# EAGLE design CC1200_Breakout (EAGLE 6.5.0)
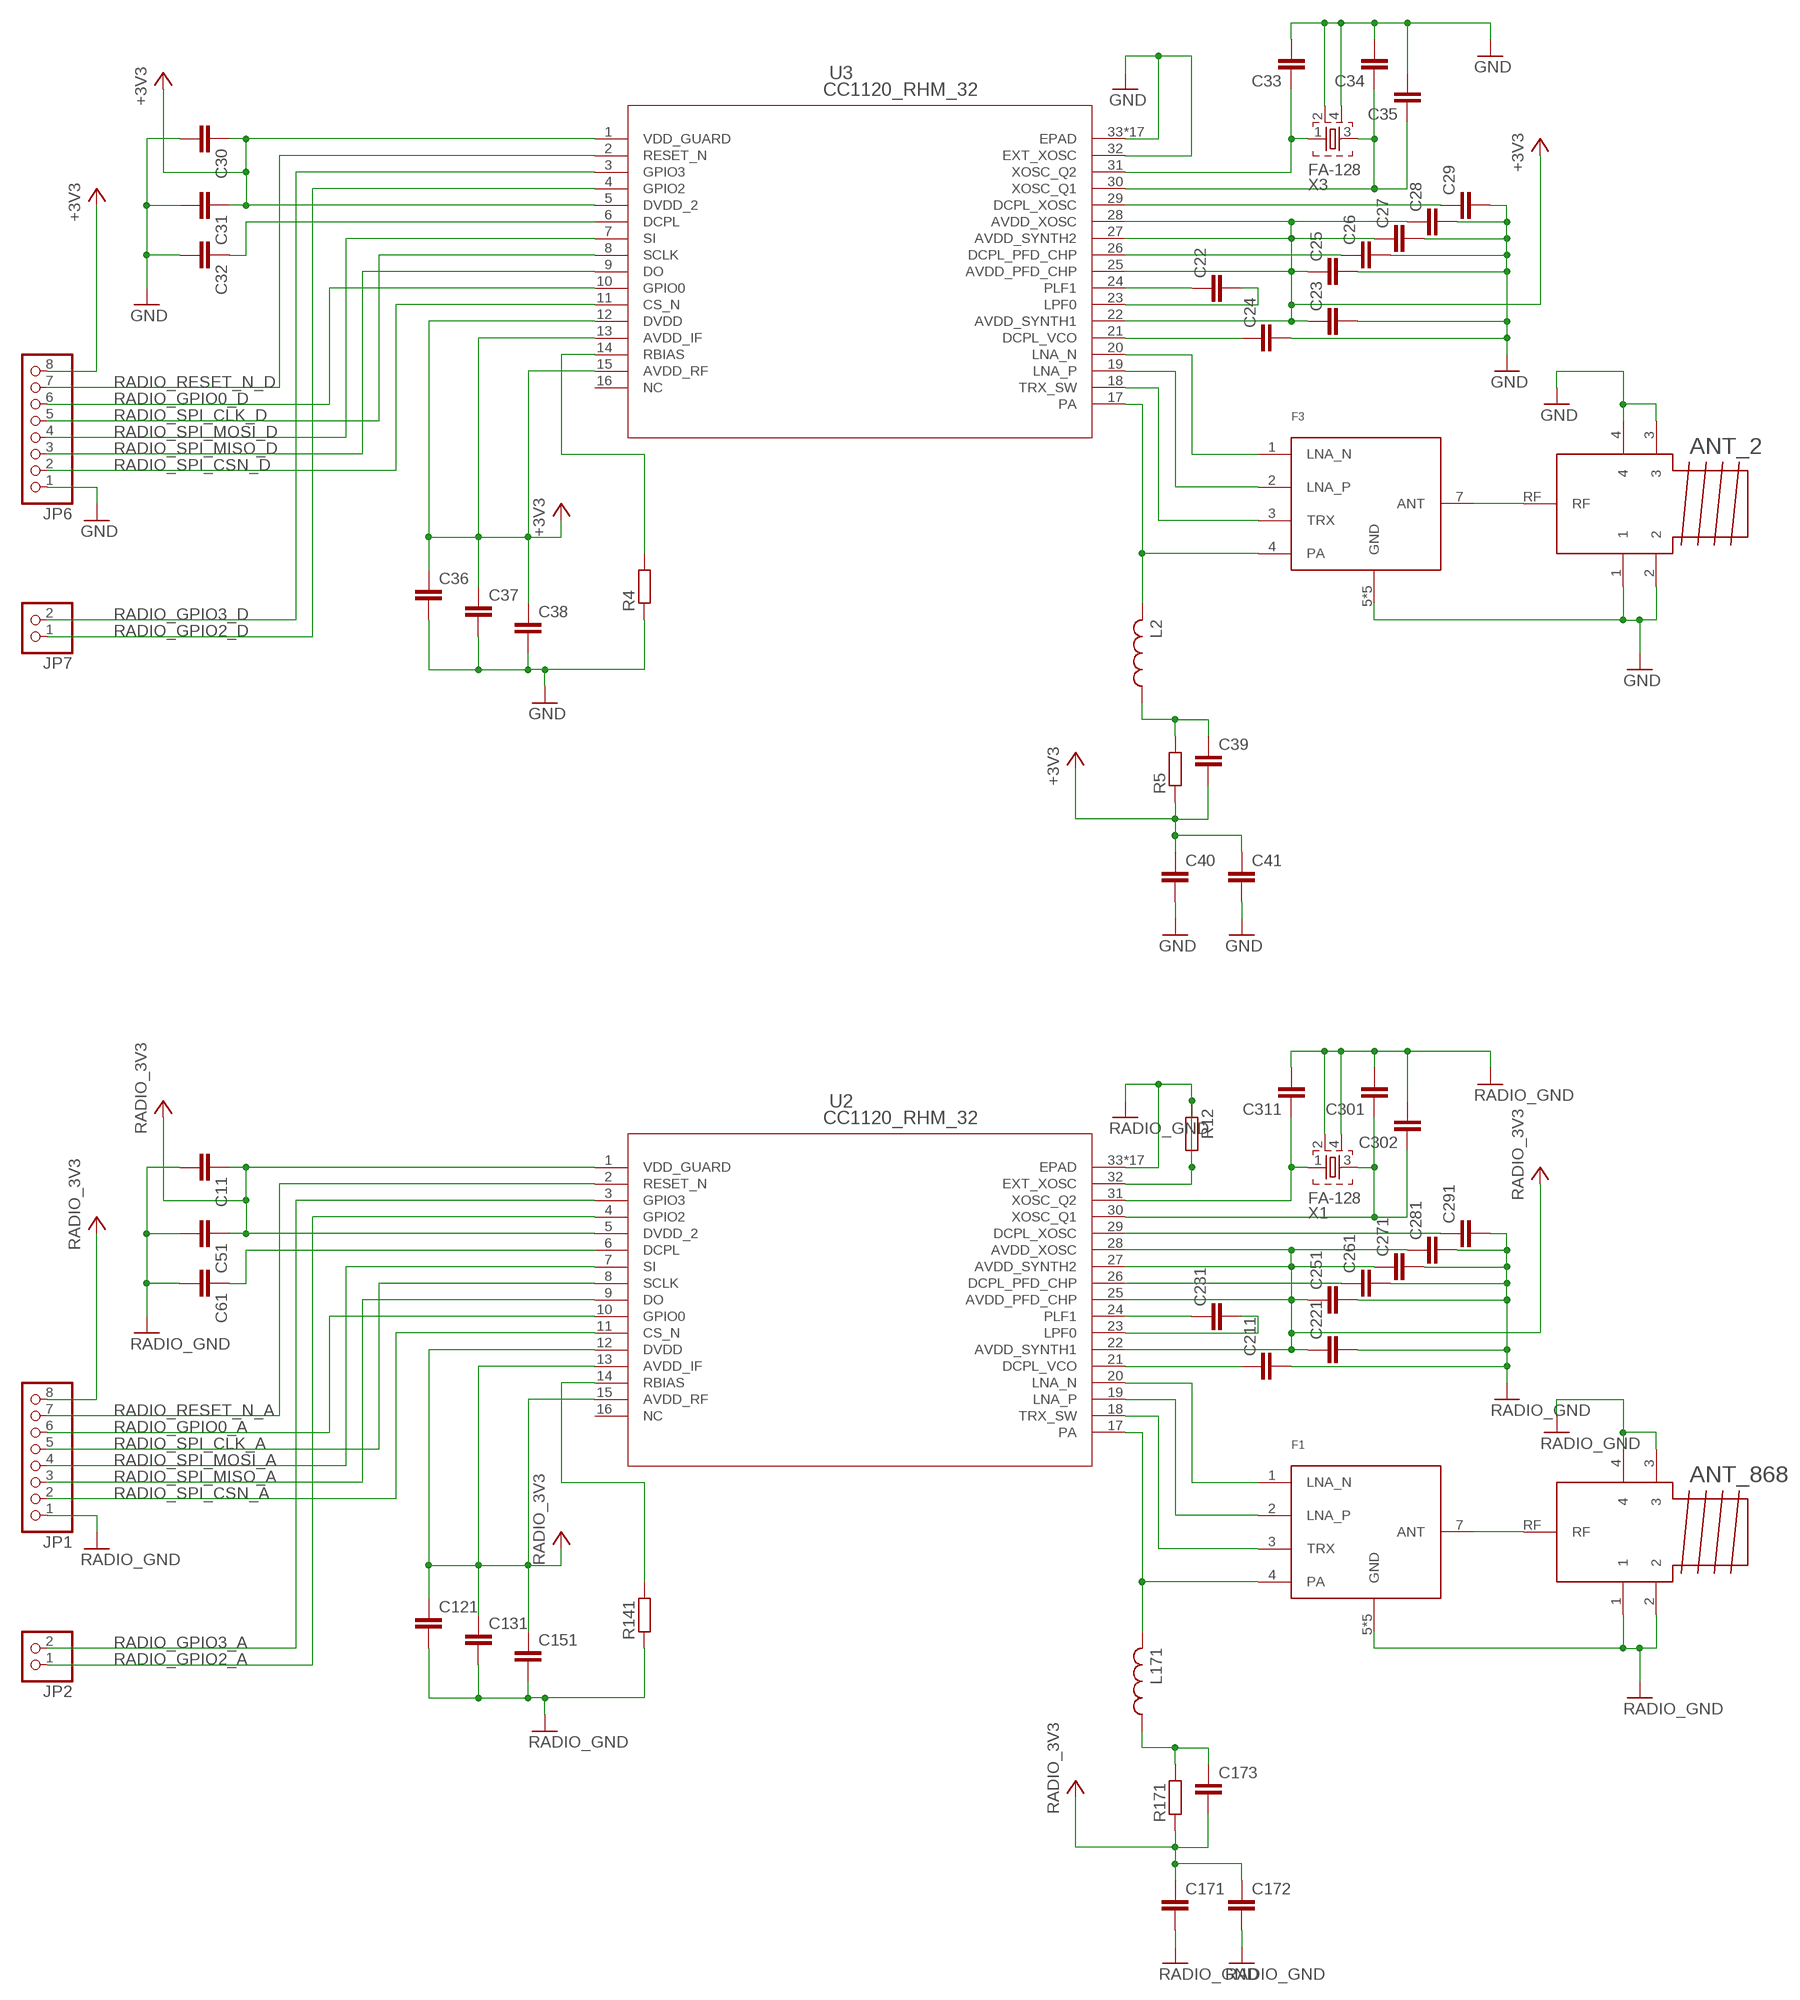
[diagram p0: schematic, sheet 1, part 1 of 3]
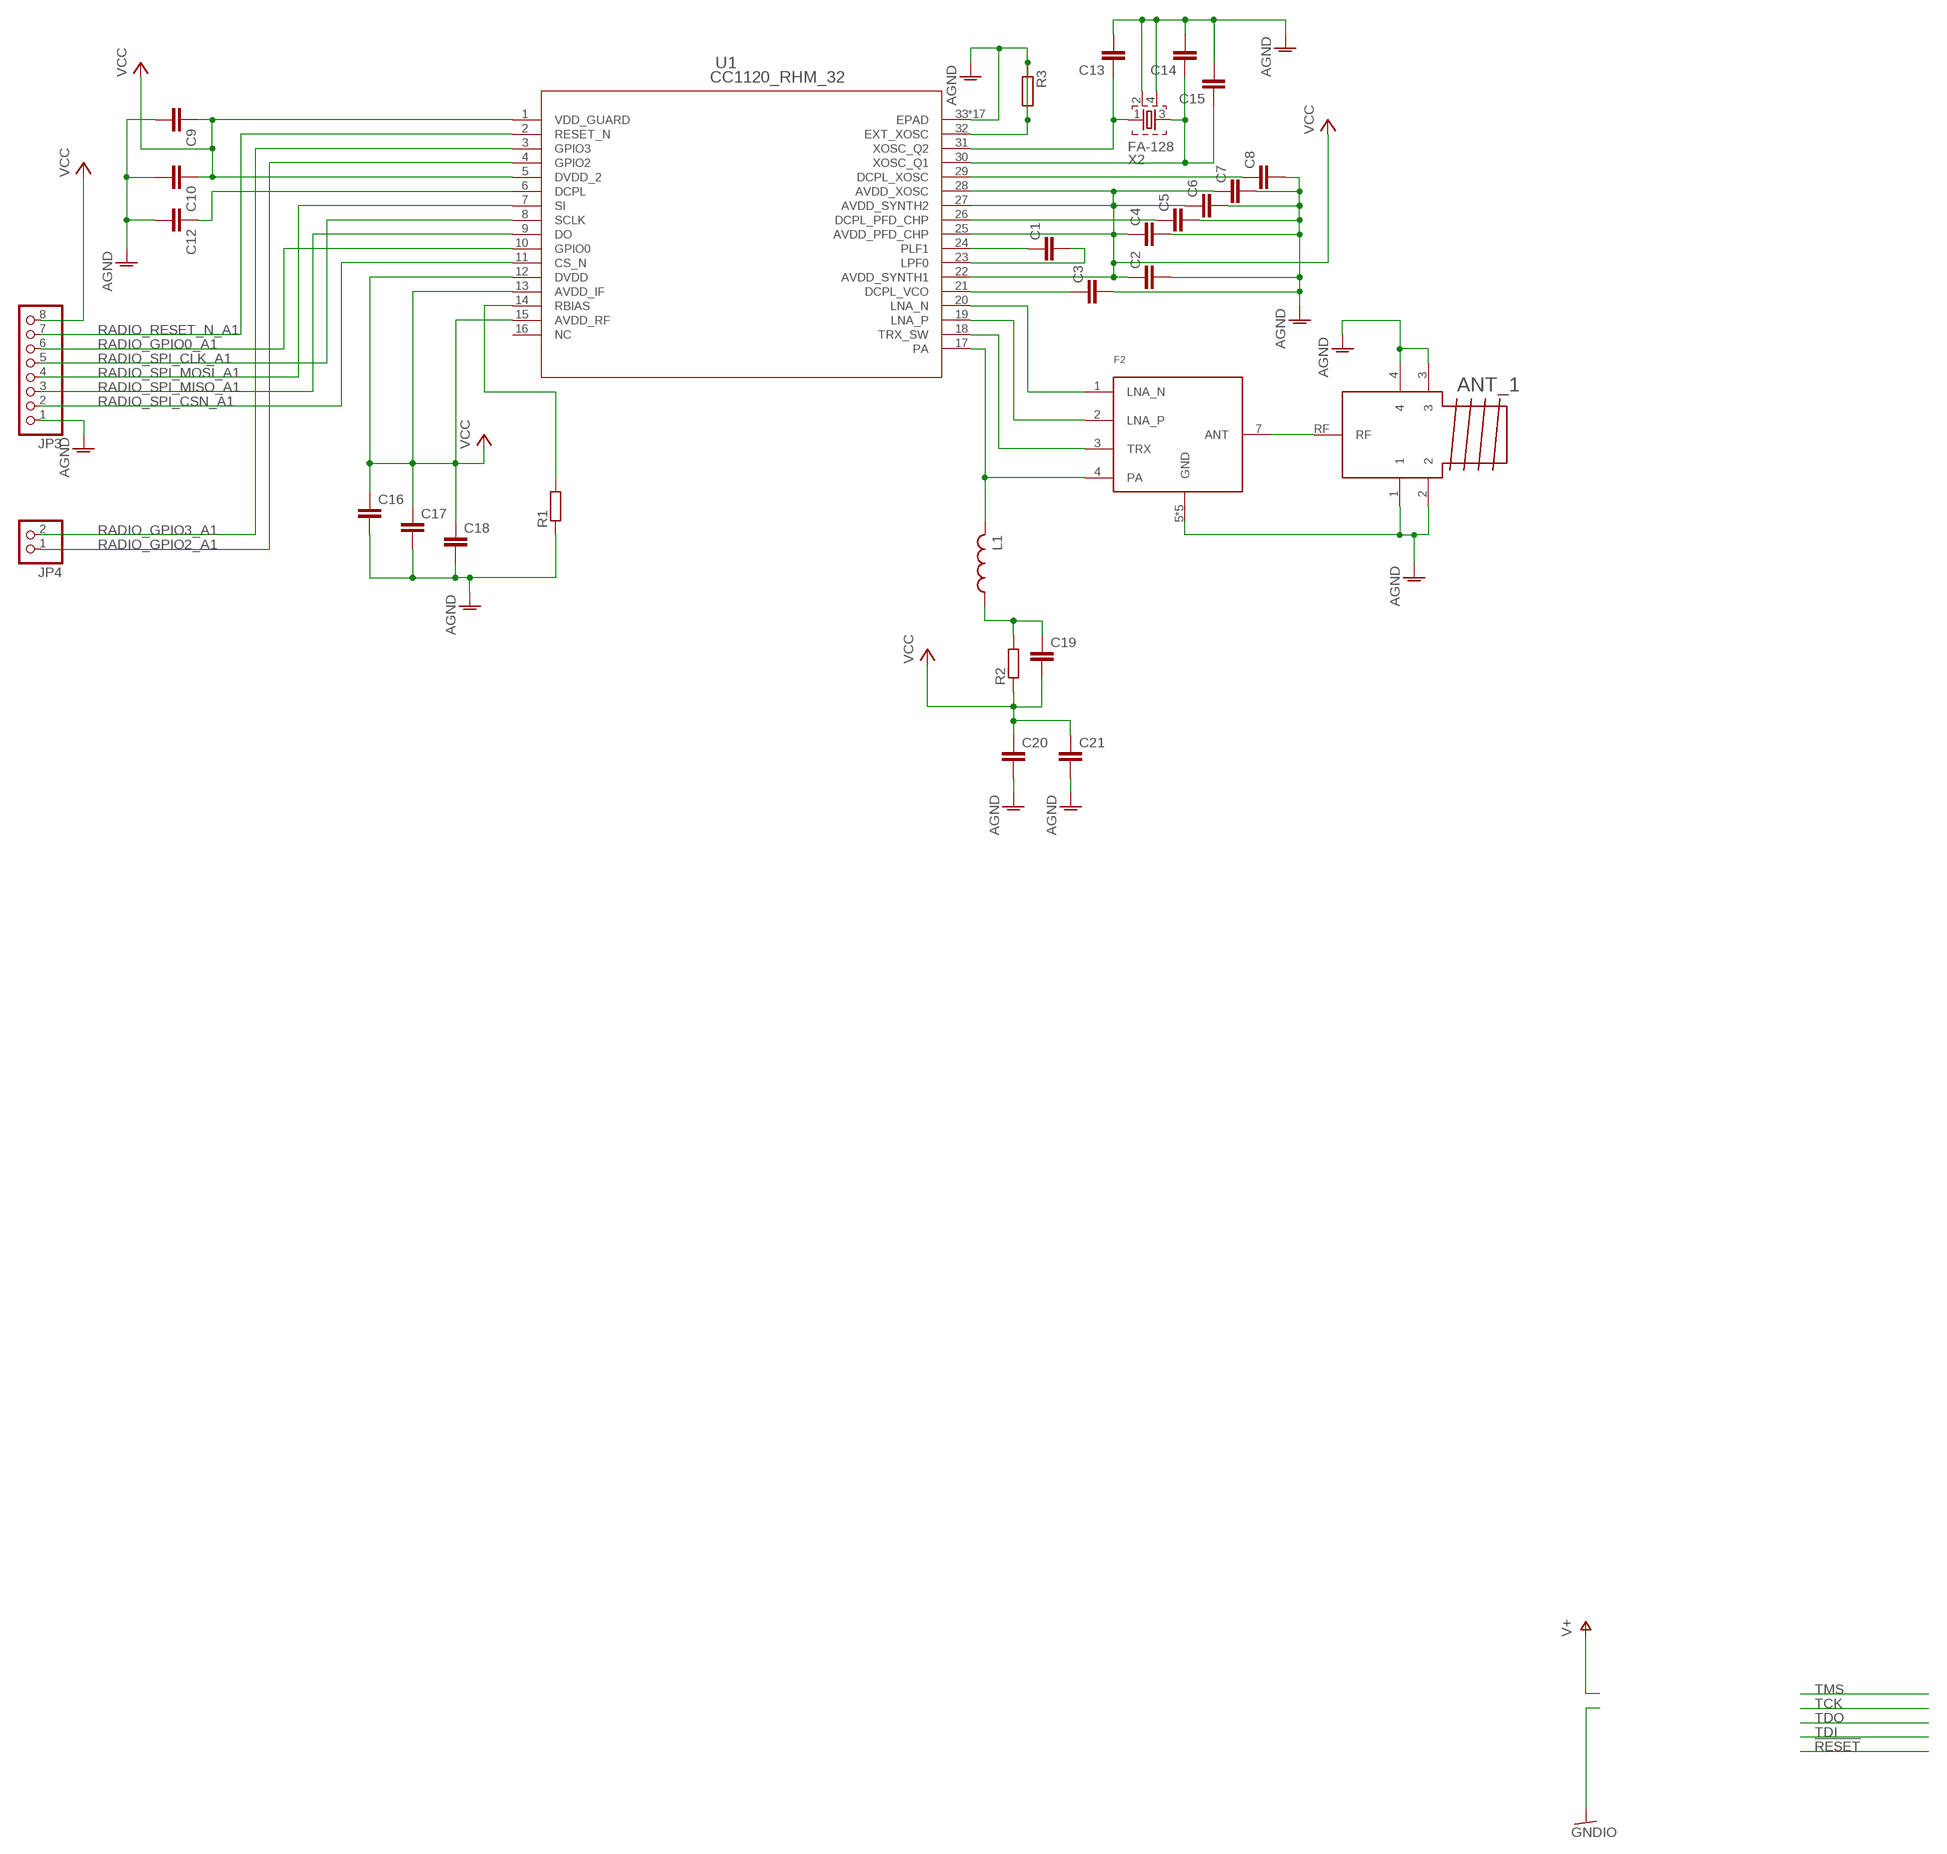
[diagram p1: schematic, sheet 1, part 2 of 3]
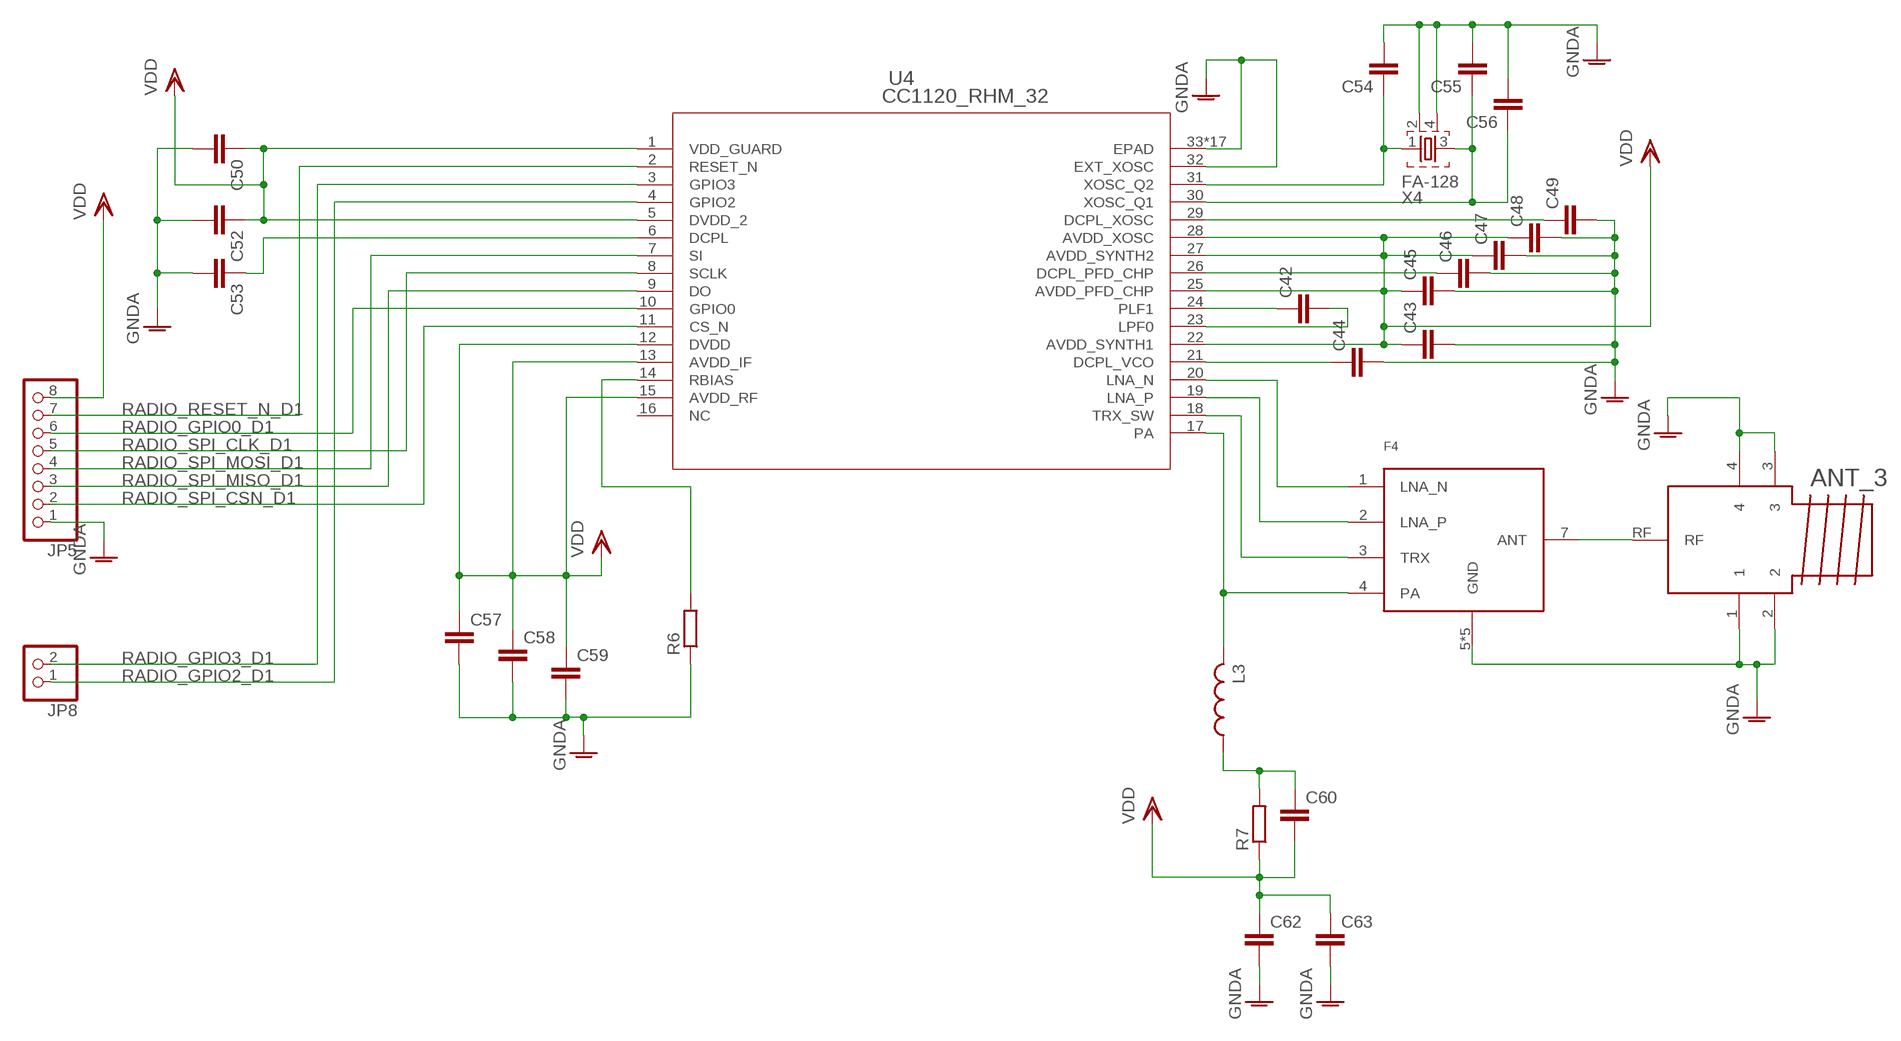
[diagram p2: schematic, sheet 1, part 3 of 3]

## Parts
ANT_1  SMA  [JOHNSON_142-0701-806]
ANT_2  SMA  [JOHNSON_142-0701-806]
ANT_3  SMA  [JOHNSON_142-0701-806]
ANT_868  SMA  [JOHNSON_142-0701-806]
C1  C_EU0402S  [C0402_SMALL]
C2  C_EU0402S  [C0402_SMALL]
C3  C_EU0402S  [C0402_SMALL]
C4  C_EU0402S  [C0402_SMALL]
C5  C_EU0402S  [C0402_SMALL]
C6  C_EU0402S  [C0402_SMALL]
C7  C_EU0402S  [C0402_SMALL]
C8  C_EU0402S  [C0402_SMALL]
C9  C_EU0402S  [C0402_SMALL]
C10  C_EU0402S  [C0402_SMALL]
C11  C_EU0402S  [C0402_SMALL]
C12  C_EU0402S  [C0402_SMALL]
C13  C_EU0402S  [C0402_SMALL]
C14  C_EU0402S  [C0402_SMALL]
C15  C_EU0402S  [C0402_SMALL]
C16  C_EU0402S  [C0402_SMALL]
C17  C_EU0402S  [C0402_SMALL]
C18  C_EU0402S  [C0402_SMALL]
C19  C_EU0402S  [C0402_SMALL]
C20  C_EU0402S  [C0402_SMALL]
C21  C_EU0402S  [C0402_SMALL]
C22  C_EUC0603S  [C0603]
C23  C_EUC0603S  [C0603]
C24  C_EUC0603S  [C0603]
C25  C_EUC0603S  [C0603]
C26  C_EUC0603S  [C0603]
C27  C_EUC0603S  [C0603]
C28  C_EUC0603S  [C0603]
C29  C_EUC0603S  [C0603]
C30  C_EUC0603S  [C0603]
C31  C_EUC0603S  [C0603]
C32  C_EUC0603S  [C0603]
C33  C_EUC0603S  [C0603]
C34  C_EUC0603S  [C0603]
C35  C_EUC0603S  [C0603]
C36  C_EUC0603S  [C0603]
C37  C_EUC0603S  [C0603]
C38  C_EUC0603S  [C0603]
C39  C_EUC0603S  [C0603]
C40  C_EUC0603S  [C0603]
C41  C_EUC0603S  [C0603]
C42  C_EUC0603S  [C0603]
C43  C_EUC0603S  [C0603]
C44  C_EUC0603S  [C0603]
C45  C_EUC0603S  [C0603]
C46  C_EUC0603S  [C0603]
C47  C_EUC0603S  [C0603]
C48  C_EUC0603S  [C0603]
C49  C_EUC0603S  [C0603]
C50  C_EUC0603S  [C0603]
C51  C_EU0402S  [C0402_SMALL]
C52  C_EUC0603S  [C0603]
C53  C_EUC0603S  [C0603]
C54  C_EUC0603S  [C0603]
C55  C_EUC0603S  [C0603]
C56  C_EUC0603S  [C0603]
C57  C_EUC0603S  [C0603]
C58  C_EUC0603S  [C0603]
C59  C_EUC0603S  [C0603]
C60  C_EUC0603S  [C0603]
C61  C_EU0402S  [C0402_SMALL]
C62  C_EUC0603S  [C0603]
C63  C_EUC0603S  [C0603]
C121  C_EU0402S  [C0402_SMALL]
C131  C_EU0402S  [C0402_SMALL]
C151  C_EU0402S  [C0402_SMALL]
C171  C_EU0402S  [C0402_SMALL]
C172  C_EU0402S  [C0402_SMALL]
C173  C_EU0402S  [C0402_SMALL]
C211  C_EU0402S  [C0402_SMALL]
C221  C_EU0402S  [C0402_SMALL]
C231  C_EU0402S  [C0402_SMALL]
C251  C_EU0402S  [C0402_SMALL]
C261  C_EU0402S  [C0402_SMALL]
C271  C_EU0402S  [C0402_SMALL]
C281  C_EU0402S  [C0402_SMALL]
C291  C_EU0402S  [C0402_SMALL]
C301  C_EU0402S  [C0402_SMALL]
C302  C_EU0402S  [C0402_SMALL]
C311  C_EU0402S  [C0402_SMALL]
F1  0900PC15J0013  [0900PC15J0013]
F2  0900PC15J0013  [0900PC15J0013]
F3  0900PC15J0013  [0900PC15J0013]
F4  0900PC15J0013  [0900PC15J0013]
JP1  PINHD-1X8  [1X08]
JP2  PINHD-1X2  [1X02]
JP3  PINHD-1X8  [1X08]
JP4  PINHD-1X2  [1X02]
JP5  PINHD-1X8  [1X08]
JP6  PINHD-1X8  [1X08]
JP7  PINHD-1X2  [1X02]
JP8  PINHD-1X2  [1X02]
L1  L_US0402S  [C0402_SMALL]
L2  L_US0603  [C0603]
L3  L_US0603  [C0603]
L171  L_US0402S  [C0402_SMALL]
R1  R_EU  [C0402_SMALL]
R2  R_EU  [C0402_SMALL]
R3  R_EU  [C0402_SMALL]
R4  R-EU_R0603  [R0603]
R5  R-EU_R0603  [R0603]
R6  R-EU_R0603  [R0603]
R7  R-EU_R0603  [R0603]
R12  R_EU  [C0402_SMALL]
R141  R_EU  [C0402_SMALL]
R171  R_EU  [C0402_SMALL]
U1  CC1120_RHM_32  [RHM32_3P7X3P7]
U2  CC1120_RHM_32  [RHM32_3P7X3P7]
U3  CC1120_RHM_32  [RHM32_3P7X3P7]
U4  CC1120_RHM_32  [RHM32_3P7X3P7]
X1  FA-128  [FA-128]
X2  FA-128  [FA-128]
X3  FA-128  [FA-128]
X4  FA-128  [FA-128]

## Nets
+3V3: C23.1 C25.1 C27.1 C28.1 C30.1 C31.1 C36.1 C37.1 C38.1 C39.2 C40.1 C41.1 JP6.8 R5.1 U3.1(VDD_GUARD) U3.5(DVDD_2) U3.12(DVDD) U3.13(AVDD_IF) U3.15(AVDD_RF) U3.22(AVDD_SYNTH1) U3.25(AVDD_PFD_CHP) U3.27(AVDD_SYNTH2) U3.28(AVDD_XOSC)
AGND: ANT_1.1 ANT_1.2 ANT_1.3 ANT_1.4 C2.2 C3.2 C4.2 C5.2 C6.2 C7.2 C8.2 C9.2 C10.2 C12.2 C13.2 C14.2 C15.2 C16.2 C17.2 C18.2 C20.2 C21.2 F2.5(GND) F2.6(GND) F2.8(GND) F2.9(GND) F2.10(GND) JP3.1 R1.1 R3.1 R3.2 U1.32(EXT_XOSC) U1.33(EPAD) U1.V(EPAD) U1.V_2(EPAD) U1.V_3(EPAD) U1.V_4(EPAD) U1.V_5(EPAD) U1.V_6(EPAD) U1.V_7(EPAD) U1.V_8(EPAD) U1.V_9(EPAD) U1.V_10(EPAD) U1.V_11(EPAD) U1.V_12(EPAD) U1.V_13(EPAD) U1.V_14(EPAD) U1.V_15(EPAD) U1.V_16(EPAD) X2.2 X2.4
GND: ANT_2.1 ANT_2.2 ANT_2.3 ANT_2.4 C23.2 C24.2 C25.2 C26.2 C27.2 C28.2 C29.2 C30.2 C31.2 C32.2 C33.2 C34.2 C35.2 C36.2 C37.2 C38.2 C40.2 C41.2 F3.5(GND) F3.6(GND) F3.8(GND) F3.9(GND) F3.10(GND) JP6.1 R4.1 U3.32(EXT_XOSC) U3.33(EPAD) U3.V(EPAD) U3.V_2(EPAD) U3.V_3(EPAD) U3.V_4(EPAD) U3.V_5(EPAD) U3.V_6(EPAD) U3.V_7(EPAD) U3.V_8(EPAD) U3.V_9(EPAD) U3.V_10(EPAD) U3.V_11(EPAD) U3.V_12(EPAD) U3.V_13(EPAD) U3.V_14(EPAD) U3.V_15(EPAD) U3.V_16(EPAD) X3.2 X3.4
GNDA: ANT_3.1 ANT_3.2 ANT_3.3 ANT_3.4 C43.2 C44.2 C45.2 C46.2 C47.2 C48.2 C49.2 C50.2 C52.2 C53.2 C54.2 C55.2 C56.2 C57.2 C58.2 C59.2 C62.2 C63.2 F4.5(GND) F4.6(GND) F4.8(GND) F4.9(GND) F4.10(GND) JP5.1 R6.1 U4.32(EXT_XOSC) U4.33(EPAD) U4.V(EPAD) U4.V_2(EPAD) U4.V_3(EPAD) U4.V_4(EPAD) U4.V_5(EPAD) U4.V_6(EPAD) U4.V_7(EPAD) U4.V_8(EPAD) U4.V_9(EPAD) U4.V_10(EPAD) U4.V_11(EPAD) U4.V_12(EPAD) U4.V_13(EPAD) U4.V_14(EPAD) U4.V_15(EPAD) U4.V_16(EPAD) X4.2 X4.4
N$1: C231.1 U2.24(PLF1)
N$2: C231.2 U2.23(LPF0)
N$3: C211.1 U2.21(DCPL_VCO)
N$4: C61.1 U2.6(DCPL)
N$5: C261.1 U2.26(DCPL_PFD_CHP)
N$6: C311.1 U2.31(XOSC_Q2) X1.1
N$7: C301.1 C302.1 U2.30(XOSC_Q1) X1.3
N$8: C291.1 U2.29(DCPL_XOSC)
N$9: F1.1(LNA_N) U2.20(LNA_N)
N$10: F1.2(LNA_P) U2.19(LNA_P)
N$11: ANT_868.RF F1.7(ANT)
N$12: F1.3(TRX) U2.18(TRX_SW)
N$13: R141.2 U2.14(RBIAS)
N$14: F1.4(PA) L171.2 U2.17(PA)
N$15: C1.1 U1.24(PLF1)
N$16: C1.2 U1.23(LPF0)
N$17: C3.1 U1.21(DCPL_VCO)
N$18: C5.1 U1.26(DCPL_PFD_CHP)
N$19: C173.1 L171.1 R171.2
N$20: C8.1 U1.29(DCPL_XOSC)
N$21: C12.1 U1.6(DCPL)
N$22: C13.1 U1.31(XOSC_Q2) X2.1
N$23: C14.1 C15.1 U1.30(XOSC_Q1) X2.3
N$24: R1.2 U1.14(RBIAS)
N$25: F2.1(LNA_N) U1.20(LNA_N)
N$26: F2.2(LNA_P) U1.19(LNA_P)
N$27: F2.3(TRX) U1.18(TRX_SW)
N$28: F2.4(PA) L1.2 U1.17(PA)
N$29: C19.1 L1.1 R2.2
N$30: ANT_1.RF F2.7(ANT)
N$31: C22.1 U3.24(PLF1)
N$32: C22.2 U3.23(LPF0)
N$33: C24.1 U3.21(DCPL_VCO)
N$34: C26.1 U3.26(DCPL_PFD_CHP)
N$35: C29.1 U3.29(DCPL_XOSC)
N$36: C32.1 U3.6(DCPL)
N$37: C33.1 U3.31(XOSC_Q2) X3.1
N$38: C34.1 C35.1 U3.30(XOSC_Q1) X3.3
N$39: R4.2 U3.14(RBIAS)
N$40: F3.1(LNA_N) U3.20(LNA_N)
N$41: F3.2(LNA_P) U3.19(LNA_P)
N$42: F3.3(TRX) U3.18(TRX_SW)
N$43: F3.4(PA) L2.2 U3.17(PA)
N$44: C39.1 L2.1 R5.2
N$45: ANT_2.RF F3.7(ANT)
N$46: C42.1 U4.24(PLF1)
N$47: C42.2 U4.23(LPF0)
N$48: C44.1 U4.21(DCPL_VCO)
N$49: C46.1 U4.26(DCPL_PFD_CHP)
N$50: C49.1 U4.29(DCPL_XOSC)
N$51: C53.1 U4.6(DCPL)
N$52: C54.1 U4.31(XOSC_Q2) X4.1
N$53: C55.1 C56.1 U4.30(XOSC_Q1) X4.3
N$54: R6.2 U4.14(RBIAS)
N$55: F4.1(LNA_N) U4.20(LNA_N)
N$56: F4.2(LNA_P) U4.19(LNA_P)
N$57: F4.3(TRX) U4.18(TRX_SW)
N$58: F4.4(PA) L3.2 U4.17(PA)
N$59: C60.1 L3.1 R7.2
N$60: ANT_3.RF F4.7(ANT)
RADIO_3V3: C11.1 C51.1 C121.1 C131.1 C151.1 C171.1 C172.1 C173.2 C221.1 C251.1 C271.1 C281.1 JP1.8 R171.1 U2.1(VDD_GUARD) U2.5(DVDD_2) U2.12(DVDD) U2.13(AVDD_IF) U2.15(AVDD_RF) U2.22(AVDD_SYNTH1) U2.25(AVDD_PFD_CHP) U2.27(AVDD_SYNTH2) U2.28(AVDD_XOSC)
RADIO_GND: ANT_868.1 ANT_868.2 ANT_868.3 ANT_868.4 C11.2 C51.2 C61.2 C121.2 C131.2 C151.2 C171.2 C172.2 C211.2 C221.2 C251.2 C261.2 C271.2 C281.2 C291.2 C301.2 C302.2 C311.2 F1.5(GND) F1.6(GND) F1.8(GND) F1.9(GND) F1.10(GND) JP1.1 R12.1 R12.2 R141.1 U2.32(EXT_XOSC) U2.33(EPAD) U2.V(EPAD) U2.V_2(EPAD) U2.V_3(EPAD) U2.V_4(EPAD) U2.V_5(EPAD) U2.V_6(EPAD) U2.V_7(EPAD) U2.V_8(EPAD) U2.V_9(EPAD) U2.V_10(EPAD) U2.V_11(EPAD) U2.V_12(EPAD) U2.V_13(EPAD) U2.V_14(EPAD) U2.V_15(EPAD) U2.V_16(EPAD) X1.2 X1.4
RADIO_GPIO0_A: JP1.6 U2.10(GPIO0)
RADIO_GPIO0_A1: JP3.6 U1.10(GPIO0)
RADIO_GPIO0_D: JP6.6 U3.10(GPIO0)
RADIO_GPIO0_D1: JP5.6 U4.10(GPIO0)
RADIO_GPIO2_A: JP2.1 U2.4(GPIO2)
RADIO_GPIO2_A1: JP4.1 U1.4(GPIO2)
RADIO_GPIO2_D: JP7.1 U3.4(GPIO2)
RADIO_GPIO2_D1: JP8.1 U4.4(GPIO2)
RADIO_GPIO3_A: JP2.2 U2.3(GPIO3)
RADIO_GPIO3_A1: JP4.2 U1.3(GPIO3)
RADIO_GPIO3_D: JP7.2 U3.3(GPIO3)
RADIO_GPIO3_D1: JP8.2 U4.3(GPIO3)
RADIO_RESET_N_A: JP1.7 U2.2(RESET_N)
RADIO_RESET_N_A1: JP3.7 U1.2(RESET_N)
RADIO_RESET_N_D: JP6.7 U3.2(RESET_N)
RADIO_RESET_N_D1: JP5.7 U4.2(RESET_N)
RADIO_SPI_CLK_A: JP1.5 U2.8(SCLK)
RADIO_SPI_CLK_A1: JP3.5 U1.8(SCLK)
RADIO_SPI_CLK_D: JP6.5 U3.8(SCLK)
RADIO_SPI_CLK_D1: JP5.5 U4.8(SCLK)
RADIO_SPI_CSN_A: JP1.2 U2.11(CS_N)
RADIO_SPI_CSN_A1: JP3.2 U1.11(CS_N)
RADIO_SPI_CSN_D: JP6.2 U3.11(CS_N)
RADIO_SPI_CSN_D1: JP5.2 U4.11(CS_N)
RADIO_SPI_MISO_A: JP1.3 U2.9(DO)
RADIO_SPI_MISO_A1: JP3.3 U1.9(DO)
RADIO_SPI_MISO_D: JP6.3 U3.9(DO)
RADIO_SPI_MISO_D1: JP5.3 U4.9(DO)
RADIO_SPI_MOSI_A: JP1.4 U2.7(SI)
RADIO_SPI_MOSI_A1: JP3.4 U1.7(SI)
RADIO_SPI_MOSI_D: JP6.4 U3.7(SI)
RADIO_SPI_MOSI_D1: JP5.4 U4.7(SI)
VCC: C2.1 C4.1 C6.1 C7.1 C9.1 C10.1 C16.1 C17.1 C18.1 C19.2 C20.1 C21.1 JP3.8 R2.1 U1.1(VDD_GUARD) U1.5(DVDD_2) U1.12(DVDD) U1.13(AVDD_IF) U1.15(AVDD_RF) U1.22(AVDD_SYNTH1) U1.25(AVDD_PFD_CHP) U1.27(AVDD_SYNTH2) U1.28(AVDD_XOSC)
VDD: C43.1 C45.1 C47.1 C48.1 C50.1 C52.1 C57.1 C58.1 C59.1 C60.2 C62.1 C63.1 JP5.8 R7.1 U4.1(VDD_GUARD) U4.5(DVDD_2) U4.12(DVDD) U4.13(AVDD_IF) U4.15(AVDD_RF) U4.22(AVDD_SYNTH1) U4.25(AVDD_PFD_CHP) U4.27(AVDD_SYNTH2) U4.28(AVDD_XOSC)
Unconnected: U1.16(NC) U2.16(NC) U3.16(NC) U4.16(NC)

## Library data of the parts
ANT_1-ANT_3 ANT_868 = CC11x:SMA
C1-C63 C121 C131 C151 C171-C173 C211 C221 C231 C251 C261 C271 C281 C291 C301 C302 C311 = CC11x:C_EU
F1-F4 = CC11x:0900PC15J0013: CC1120 one-piece output filter. http://onecall.farnell.com/johanson-technology/0900pc15j0013e/balun-imp-matched-868-928mhz-chip/dp/2341894 http://www.johansontechnology.com/datasheets/highly-integrated-passive-components/0900PC15J0013.pdf
JP1 JP3 JP5 JP6 = pinhead:PINHD-1X8: PIN HEADER
JP2 JP4 JP7 JP8 = pinhead:PINHD-1X2: PIN HEADER
L1-L3 L171 = CC11x:L_US
R1-R3 R12 R141 R171 = CC11x:R_EU
R4-R7 = rcl:R-EU_: RESISTOR, European symbol
U1-U4 = CC11x:CC1120_RHM_32; DATASHEETURL: http://www.ti.com/lit/gpn/CC1120; DESCRIPTION: High Performance RF Transceiver for Narrowband Systems; FAMILY_NAME: SUB-1 GHZ; GENERIC_PART_NUMBER: CC1120; INDUSTRY_STD_PKG_TYPE: QFN; MANUFACTURER: Texas Instruments; PACKAGE_DESIGNATOR: RHM; PIN_COUNT: 32
X1-X4 = crystal:FA-: MHz RANGE CRYSTAL UNIT Source: Epson Toyocom

## Board
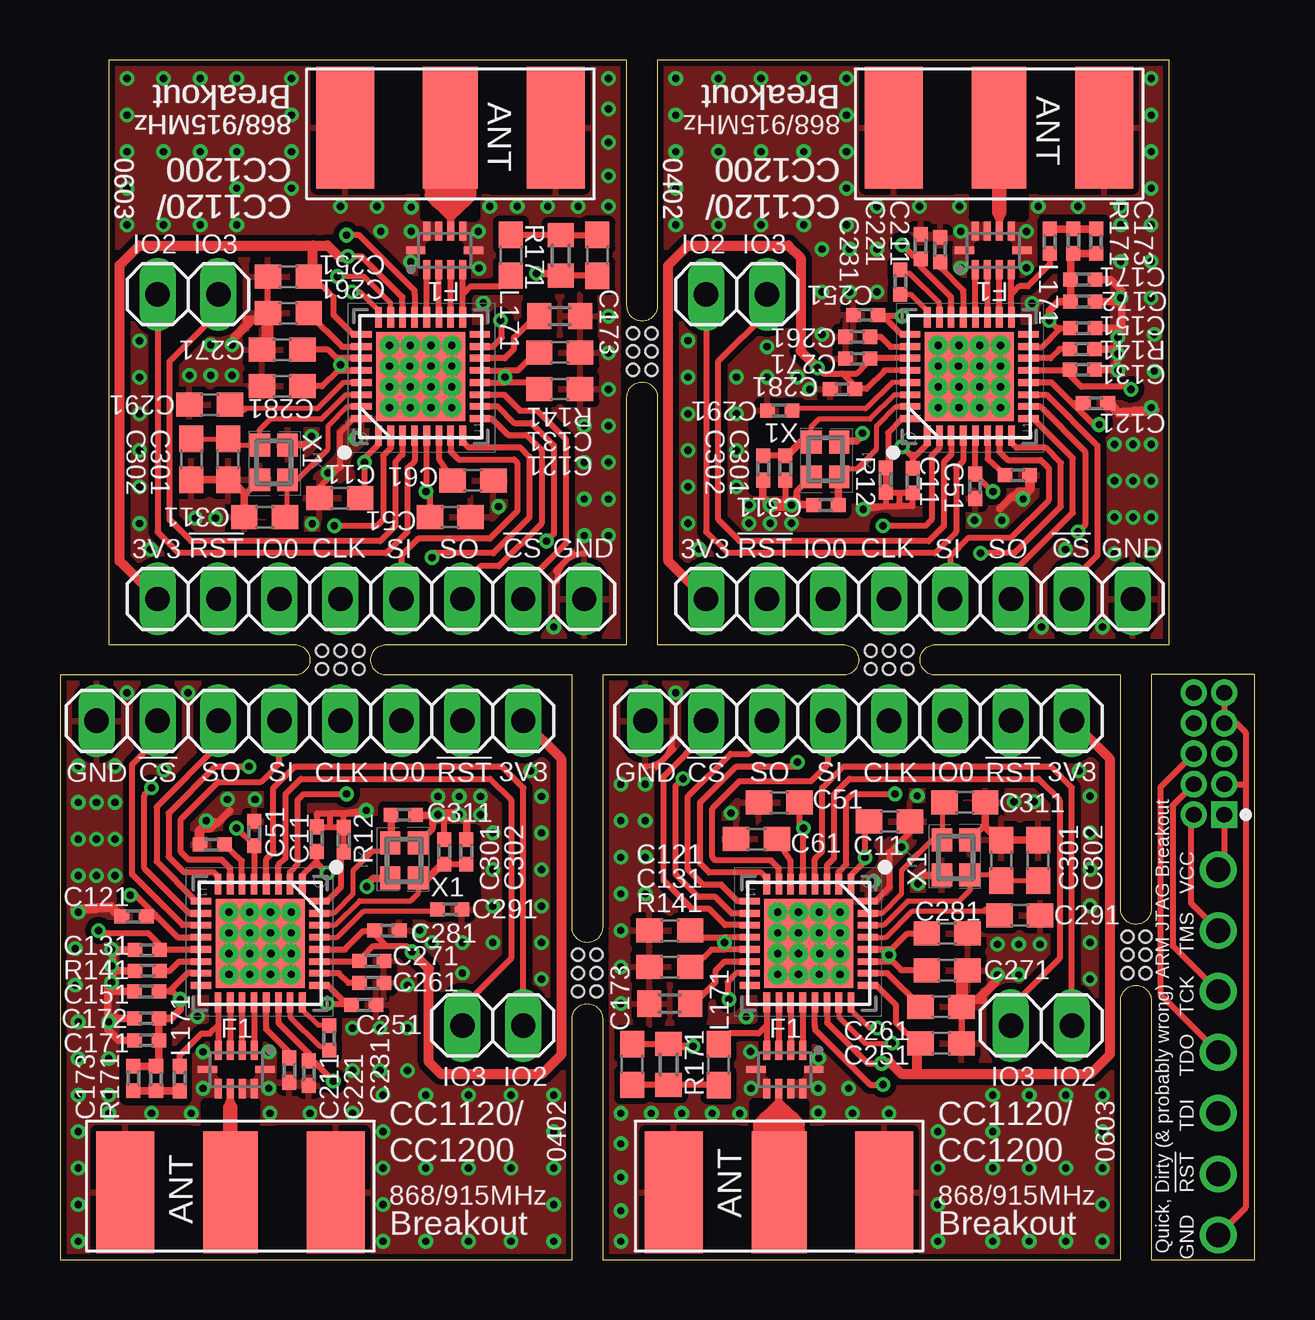
[diagram p3: board, top side]
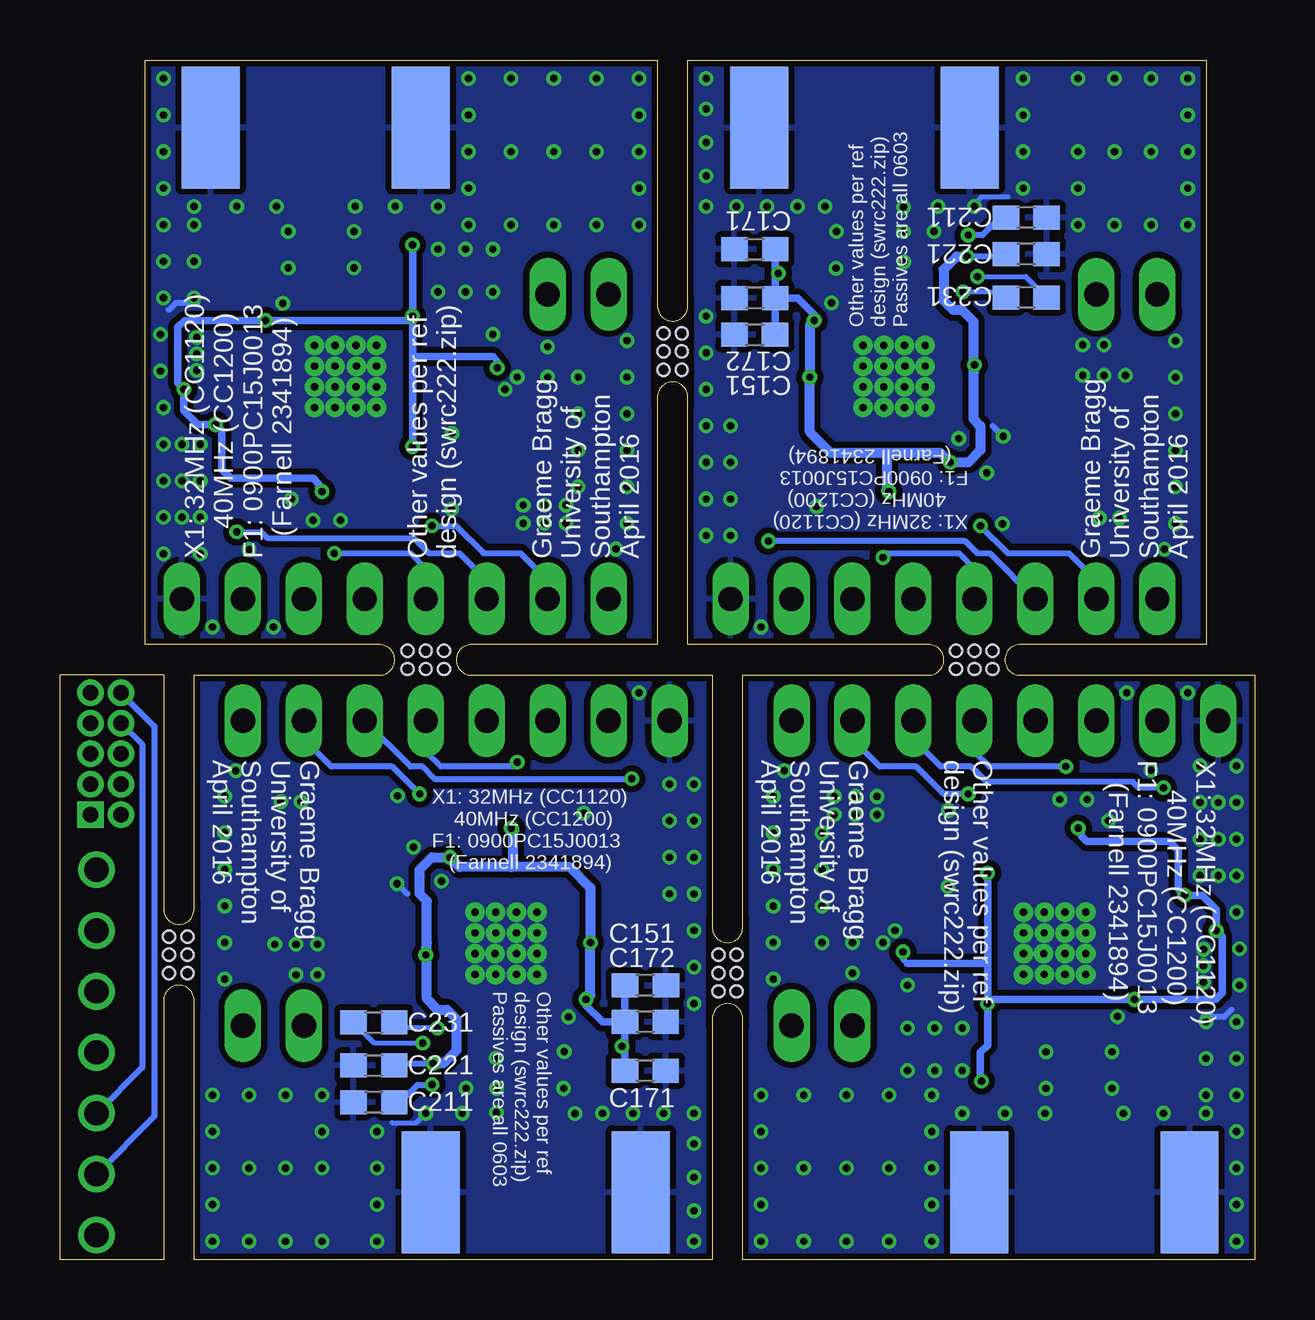
[diagram p4: board, bottom side, seen from below]

Size 49.78 x 50 mm. Coordinates in mm from the lower left corner, seen from the top.
Outline: 0,0 21.34,0 21.34,10.02 arc-180 22.61,10.05 22.61,0 44.2,0 44.2,10.79 arc-180 45.47,10.79 45.47,0 49.78,0 49.78,24.38 45.47,24.38 45.47,14.61 arc-180 44.2,14.61 44.2,24.36 36.47,24.36 arc-180 36.47,25.63 46.23,25.63 46.23,50 24.89,50 24.89,39.75 arc-180 23.62,39.75 23.62,50 2.03,50 2.03,25.63 9.78,25.63 arc-180 9.78,24.36 0,24.36 0,0
Outline: 32.64,24.36 22.61,24.36 22.61,13.84 arc-180 21.34,13.84 21.34,24.36 13.59,24.36 arc-180 13.59,25.63 23.62,25.63 23.62,35.94 arc-180 24.89,35.94 24.89,25.63 32.64,25.63 arc-180 32.64,24.36
Copper layers (1+2*15+16): Top 0.035mm / dielectric 0.2mm / Route2 0.0175mm / dielectric 1.2mm / Route15 0.0175mm / dielectric 0.2mm / Bottom 0.035mm
Design rules "dirt_cheap_dirty_boards.v1 *": minimum track width 5mil, minimum drill 12mil, track to track 5mil, track to pad 5mil, pad to pad 5mil, via to via 5mil, smd to smd 0mil, copper to edge 10mil, drill to drill 10mil, minimum pad ring 10mil, minimum via ring 6mil, stop-mask expansion 2mil, vias tented up to drill 25mil, thermal gap 10mil
Holes 0.5 mm at 10.92,25.37 11.68,25.37 12.45,25.37 12.45,24.61 11.68,24.61 10.92,24.61 21.59,11.18 21.59,11.94 21.59,12.7 22.35,12.7 22.35,11.94 22.35,11.18 33.78,25.37 34.54,25.37 35.31,25.37 35.31,24.61 34.54,24.61 33.78,24.61 23.88,37.08 23.88,37.85 23.88,38.61 24.64,38.61 24.64,37.85 24.64,37.08 44.48,11.94 44.48,12.7 44.48,13.46 45.24,13.46 45.24,12.7 45.24,11.94
tRestrict: area 2.7,10.6 to 5.2,13.3; area 10.2,14.7 to 12,17; area 12.8,15.1 to 15.2,18.2; area 9.9,16.5 to 12.8,18.2; area 15.2,15.1 to 17.3,17.9; area 6.4,8.3 to 8.2,10.4; area 2.7,6.7 to 4.4,10.6; area 4.4,6.7 to 5.3,8.5; area 6.1,5.3 to 8.2,6.5; area 13.5,18.2 to 15.2,18.8; area 29.3,8.3 to 31.1,10.4; area 28.9,5.3 to 31,6.5; 22 more areas
bRestrict: area 32.3,24.4 to 36.8,25.6; area 44.2,10.4 to 45.5,15; area 21.3,9.7 to 22.6,14.2; area 9.4,24.4 to 14,25.6; area 23.6,35.6 to 24.9,40.1; area 32.3,24.4 to 36.8,25.6

### Footprints (pad centres in the part's own frame; a part is rotated, then mirrored left to right if it is on the bottom)
JOHNSON_142-0701-806 = smd 2.413 x 5.08: 1 -4.381,-2.54; 2 4.381,-2.54 | smd 2.413 x 5.08 bottom: 3 4.381,-2.54; 4 -4.381,-2.54 | smd 2.286 x 5.08: RF 0,-2.54
C0402_SMALL = smd 0.61 x 0.584: 1 -0.536,0; 2 0.485,0
C0603 = smd 1.1 x 1: 1 -0.85,0; 2 0.85,0
0900PC15J0013 = smd 0.3 x 0.8: 1 0.75,0.8; 2 0.25,0.8; 3 -0.25,0.8; 4 -0.75,0.8; 6 -0.75,-0.8; 7 -0.25,-0.8; 8 0.25,-0.8; 9 0.75,-0.8 | smd 0.8 x 0.3: 5 -1.2,0; 10 1.2,0
1X08 = drill 1.016 long: 1 -8.89,0; 2 -6.35,0; 3 -3.81,0; 4 -1.27,0; 5 1.27,0; 6 3.81,0; 7 6.35,0; 8 8.89,0
1X02 = drill 1.016 long: 1 -1.27,0; 2 1.27,0
R0603 = smd 1 x 1.1: 1 -0.85,0; 2 0.85,0
RHM32_3P7X3P7 = smd 0.838 x 0.279: 1 -2.464,1.753; 2 -2.464,1.245; 3 -2.464,0.762; 4 -2.464,0.254; 5 -2.464,-0.254; 6 -2.464,-0.762; 7 -2.464,-1.245; 8 -2.464,-1.753; 17 2.464,-1.753; 18 2.464,-1.245; 19 2.464,-0.762; 20 2.464,-0.254; 21 2.464,0.254; 22 2.464,0.762; 23 2.464,1.245; 24 2.464,1.753 | smd 0.279 x 0.838: 9 -1.753,-2.464; 10 -1.245,-2.464; 11 -0.762,-2.464; 12 -0.254,-2.464; 13 0.254,-2.464; 14 0.762,-2.464; 15 1.245,-2.464; 16 1.753,-2.464; 25 1.753,2.464; 26 1.245,2.464; 27 0.762,2.464; 28 0.254,2.464; 29 -0.254,2.464; 30 -0.762,2.464; 31 -1.245,2.464; 32 -1.753,2.464 | smd 3.708 x 3.708: 33 0,0 | drill 0.305: V 1.295,1.295; V_2 -1.295,-0.432; V_3 -1.295,-1.295; V_4 -1.295,0.432; V_5 -1.295,1.295; V_6 -0.432,-1.295; V_7 -0.432,-0.432; V_8 -0.432,0.432; V_9 -0.432,1.295; V_10 0.432,-1.295; V_11 0.432,-0.432; V_12 0.432,0.457; V_13 0.432,1.295; V_14 1.295,-1.295; V_15 1.295,-0.432; V_16 1.295,0.432
FA-128 = smd 0.95 x 0.85: 1 -0.725,-0.575; 2 0.725,-0.575; 3 0.725,0.575; 4 -0.725,0.575

### Placement (x,y rotation side)
ANT_1  39.13,49.72 0 top
ANT_2  29.96,0.26 180 top
ANT_3  16.27,49.72 0 top
ANT_868  7.1,0.26 180 top
C1  35.02,40.77 90 top
C2  35.86,42.24 90 top
C3  36.67,42.12 90 top
C4  33.54,39.37 180 top
C5  33.21,38.46 180 top
C6  33.21,37.54 180 top
C7  32.58,36.27 180 top
C8  29.96,35.38 180 top
C9  35.53,32.44 270 top
C10  38.13,32.2 270 top
C11  10.7,17.55 90 top
C12  39.91,32.69 0 top
C13  31.89,31.45 180 top
C14  30.22,32.97 270 top
C15  29.3,32.97 270 top
C16  43.17,35.69 0 top
C17  42.61,37.09 0 top
C18  42.64,38.81 0 top
C19  43.17,42.42 270 top
C20  42.64,40.84 0 top
C21  42.64,39.93 0 top
C22  36.71,9.89 180 bottom
C23  36.71,8.09 180 bottom
C24  36.71,6.56 180 bottom
C25  36.71,9.01 0 top
C26  36.71,10.54 0 top
C27  36.97,12.06 0 top
C28  36.97,13.59 0 top
C29  39.99,14.35 0 top
C30  34.57,18.25 0 top
C31  29.97,19.05 180 top
C32  29.02,17.52 180 top
C33  37.7,19.05 0 top
C34  39.23,16.63 90 top
C35  40.75,16.63 90 top
C36  25.41,13.71 180 top
C37  25.41,12.19 180 top
C38  25.39,11.43 0 bottom
C39  23.84,8.13 90 top
C40  25.4,7.87 0 bottom
C41  25.4,9.9 0 bottom
C42  9.52,40.1 0 bottom
C43  9.52,41.9 0 bottom
C44  9.52,43.43 0 bottom
C45  9.52,40.97 180 top
C46  9.52,39.45 180 top
C47  9.26,37.92 180 top
C48  9.26,36.4 180 top
C49  6.24,35.64 180 top
C50  11.66,31.73 180 top
C51  8.1,17.78 90 top
C52  16.26,30.94 0 top
C53  17.21,32.46 0 top
C54  8.53,30.94 180 top
C55  7,33.35 270 top
C56  5.48,33.35 270 top
C57  20.82,36.27 0 top
C58  20.82,37.8 0 top
C59  20.84,38.55 180 bottom
C60  22.39,41.86 270 top
C61  6.31,17.29 180 top
C62  20.83,42.11 180 bottom
C63  20.83,40.08 180 bottom
C121  3.06,14.3 180 top
C131  3.62,12.9 180 top
C151  3.59,11.17 180 top
C171  3.59,9.14 180 top
C172  3.59,10.06 180 top
C173  3.06,7.57 90 top
C211  9.56,7.87 270 top
C221  10.37,7.74 270 top
C231  11.21,9.22 270 top
C251  12.68,10.61 0 top
C261  13.01,11.53 0 top
C271  13.01,12.44 0 top
C281  13.65,13.71 0 top
C291  16.26,14.6 0 top
C301  16.01,17.02 90 top
C302  16.93,17.02 90 top
C311  14.33,18.54 0 top
F1  7.34,7.92 0 top
F2  38.89,42.07 180 top
F3  30.2,7.92 0 top
F4  16.03,42.07 180 top
JP1  10.41,22.45 0 top
JP2  18.03,9.75 180 top
JP3  35.81,27.53 180 top
JP4  28.19,40.23 0 top
JP5  12.95,27.53 180 top
JP6  33.27,22.45 0 top
JP7  40.89,9.75 180 top
JP8  5.33,40.23 0 top
L1  41.24,42.42 270 top
L2  27.44,8.13 90 top
L3  18.79,41.86 270 top
L171  4.99,7.57 90 top
R1  42.56,37.95 180 top
R2  42.23,42.47 90 top
R3  34.41,32.51 90 top
R4  25.41,10.67 0 top
R5  25.36,8.13 270 top
R6  20.82,39.32 180 top
R7  20.87,41.86 90 top
R12  11.82,17.47 270 top
R141  3.67,12.04 0 top
R171  4,7.52 270 top
U1  37.89,36.81 90 top
U2  8.34,13.18 270 top
U3  31.2,13.18 270 top
U4  15.03,36.81 90 top
X1  14.33,16.63 270 top
X2  31.89,33.35 90 top
X3  37.32,16.76 270 top
X4  8.91,33.23 90 top

### Tracks (layer width: path | path; a pad name or v marks a point on that pad's centre or on a via)
!RESET  (via drill 0.66 pad 1.09, 1.02 pad 1.27)
  Bottom 0.254: v47.24,23.62 45.85,22.23 45.85,5.97 v48.26,3.56
+3V3  (via drill 0.3)
  Top 0.254: U3.5 30.95,17.94 v30.98,17.98 30.82,18.14 C31.1 | C39.2 R5.1 | U3.22 31.96,10.39 31.95,10.38 31.96,9.91 31.96,9.87 33.65,8.18 v34.24,8.18 | U3.25 34.02,11.43 34.83,10.61 34.83,9.87 35.69,9.01 C25.1 | 35.98,13.69 35.98,13.56 36,13.59 C28.1 35.31,13.59 34.64,12.93 U3.28 34.54,12.93 v34.54,12.7 | 35.98,13.71 35.98,13.69 | 32.95,15.94 | 32.95,15.94 32.95,16 33.54,16.58 v33.54,16.76 33.53,16.86 33.53,18.07 33.72,18.07 C30.1 | 35.98,13.69 35.97,13.69 | 32.95,15.94 U3.1 | U3.1 | 27.69,13.43 26.54,13.43 C36.1 | v27.87,10.84 27.81,10.91 27.81,11.56 28.19,11.94 U3.15 | U3.27 34.54,12.42 | 34.54,12.42 34.7,12.42 35.05,12.06 C27.1 | 34.54,12.83 v34.54,12.7 | v34.54,12.7 34.54,12.42 | 27.69,12.93 27.15,12.93 26.41,12.19 C37.1 | U3.1 | U3.12 27.69,13.43 | 27.69,13.43 v27.69,13.21 27.69,12.93 | U3.13 27.69,12.93
  Top 0.305: R5.1 25.36,8.89 v26.37,8.89
  Top 0.406: 35.69,7.72 42.93,7.72 43.74,8.53 43.74,20.88 JP6.8 | 35.69,7.72 35.08,7.72 34.62,8.18 v34.24,8.18 | 35.69,9.01 35.69,7.72
  Bottom 0.254: v30.98,17.98 30.85,17.9 | C23.1 35.76,8.18 v34.24,8.18 | 34.16,8.18 34.21,8.13 | C38.1
  Bottom 0.305: 30.85,17.9 30.85,17.91 | C38.1 | 26.25,8.89 C41.1 | C40.1 26.25,8.89 | 26.25,8.89 v26.37,8.89 | C38.1 C41.1 | C41.1 27.18,9.91 27.87,10.6 v27.87,10.84
  Bottom 0.406: 34.5,13.21 34.5,10.88 34.04,10.41 33.66,10.41 33.26,10.02 33.26,8.72 33.8,8.18 v34.24,8.18 34.16,8.18 | 34.5,13.21 34.5,14.94 34.8,15.24 34.8,16.26 34.29,16.76 33.59,16.76 v33.54,16.76 33.13,16.36 30.99,16.36 | v34.54,12.7 34.5,13.21 | v27.87,10.84 27.69,11.03 v27.69,13.21 27.69,15.49 28.55,16.36 30.99,16.36 | 30.85,17.91 30.91,17.91 30.91,16.43 30.99,16.36
AGND  (via drill 0.3)
  Top 0.254: 30.7,31.83 30.7,32.03 31.21,32.54 | 31.21,32.54 31.32,32.65 | X2.4 31.21,32.63 31.21,32.54 | X2.2 32.55,34.08 32.55,34.1 | 31.41,31.47 C13.2 | C14.2 30.22,31.47 | C15.2 29.3,32.31 29.28,32.29 | 34.46,33.03 34.51,33.03 34.51,34.45 35.12,35.06 35.42,35.06 U1.32 | 34.41,32.98 34.35,32.92 34.41,32.92 R3.1 34.41,31.91 | 34.41,32.98 34.46,33.03 | 34.41,33.03 34.46,33.03 | R3.2 34.41,32.98 | 34.97,31.4 35.53,31.4 C9.2 | 34.46,31.95 arc-90 34.38,32.03 34.38,31.91 34.41,31.91 | 34.41,31.91 34.41,31.4 | 34.41,31.4 34.97,31.4 | 34.41,31.4 v33.47,31.27 33.47,31.36 33.5,31.39 34.84,31.4 | 34.97,31.93 34.97,31.4 | 34.29,31.95 35.56,31.95 35.53,31.98
  Top 0.304: 32.47,34.1 32.55,34.1 33.18,34.1 33.47,34.39 | 29.28,32.52 29.28,32.29 29.28,31.78 29.58,31.47 29.61,31.47 | 30.7,31.47 31.41,31.47 | 30.7,31.47 30.7,31.83 | 30.55,31.47 30.7,31.47
  Top 0.305: C10.2 | 39.16,31.3 39.67,31.8 39.79,31.8 | C18.2 44.03,38.81 44.03,37.95 | 44.03,37.95 R1.1 | C17.2 43.88,37.09 43.88,37.19 44.03,37.19 44.03,37.95 | C21.2 44.01,39.93 44.06,39.88 | C20.2 43.78,40.84 44.24,40.39 44.24,40.01 | 44.24,40.01 44.24,38.64 v44.09,38.43 | 44.16,39.93 44.24,40.01 | 33.47,34.39 33.47,34.45 v33.44,34.45
  Top 0.406: 35.5,32.01 35.53,31.98 C9.2 | C12.2 40.4,32.12 40.26,31.98 39.97,31.98 39.79,31.8 | C16.2 43.7,35.69 44.09,35.31 45.61,35.41
  Top 0.508: 29.61,31.47 30.22,31.47 30.55,31.47
  Bottom 0.254: 45.25,39.58 44.95,39.88 44.06,39.88
  other vias: 44.09,37.75 40.76,43.89 37.48,43.89 40.5,39.86 44.09,37.06 40.28,41.33 37.53,41.33 40.28,42.85 37.53,42.85 41.9,29.59 26.16,38.3 26.16,36.78 26.16,35.26 26.16,33.73 26.16,32.21 26.16,30.68 26.62,29.62 25.65,49.23 25.65,47.7 25.65,46.18 25.65,44.65 25.65,43.13 27.43,43.13 29.21,43.13 30.99,43.13 27.43,49.23 29.21,49.23 32.77,47.7 30.99,49.23 32.77,49.23 32.77,46.18 32.77,44.65 31.75,38.56 34.04,43.89 35.81,43.89 34.04,40.34 34.04,42.11 32.77,43.13 31.75,42.11 31.75,40.34 32.89,42.11 32.89,40.34 30.99,46.18 29.21,46.18 27.43,46.18 42.42,43.89 45.47,44.65 45.47,46.18 45.47,49.23 45.47,47.7 44.2,43.89 45.47,43.13 45.47,41.61 45.47,40.08 45.59,38.56 45.59,37.03 45.47,35.51 45.47,33.99 43.94,33.99 43.94,32.46 45.47,32.46 45.47,30.94 43.94,30.94 45.47,29.41 40.89,26.37 44.7,30.94 44.7,32.46 44.7,33.99 44.2,41.61 44.2,40.08 44.2,43.13 28.7,30.68 30.48,30.68 28.7,31.45 30.48,31.45 29.59,30.68 29.59,31.45 28.19,32.21 28.19,33.73 28.19,35.26 28.19,36.78 29.46,38.05 29.46,36.78 30.73,36.78 31.24,36.27 39.24,30.81 40.13,31.7 38.1,30.81 43.94,29.41 43.43,26.37
  pour Top (isolate 0.203): 40.71,40.31 40.71,44.27 37.3,44.27 37.3,40.31
  pour Top (isolate 0.254): 47.24,25.35 24.64,25.35 24.64,52.02 47.24,52.02
  pour Bottom (isolate 0.254): 47.24,25.35 24.64,25.35 24.64,55.58 47.24,55.58
GND  (via drill 0.3)
  Top 0.203: 25.65,21.84 25.51,21.7 25.51,21.35 25.59,21.27 24.85,20.53
  Top 0.229: 25.51,21.7 arc-90 24.37,20.55
  Top 0.254: 38.52,18.08 38.01,17.57 | 38.01,17.57 37.9,17.46 | X3.4 38.01,17.49 38.01,17.57 | X3.2 36.66,16.04 36.66,16.01 | U3.32 33.97,14.92 34.58,15.54 34.58,16.96 35.42,17.8 | C25.2 37.59,9.01 37.59,10.82
  Top 0.304: 36.75,16.01 36.66,16.01 35.91,16.01 35.75,15.85
  Top 0.305: 35.75,15.85 v35.75,15.67 | C35.2 C34.2 39.11,17.48 38.52,18.08 38.55,18.12 C33.2 | 34.58,16.96 34.56,16.94 v35.06,17.19
  Top 0.356: 37.59,10.82 38.23,10.82 | 38.23,10.82 38.96,11.56 | 38.46,10.82 38.23,10.82
  Top 0.406: 37.59,11.84 C27.2
  Top 0.508: 37.59,10.82 37.59,11.84
  Bottom 0.203: 35.94,5.7 34.92,5.7 34.92,5.71 v34.54,6.1
  Bottom 0.254: v35.75,15.67 35.61,15.54 35.31,15.24
  other vias: 23.37,13.72 23.37,12.19 23.37,10.67 23.37,6.1 27.18,6.1 28.77,8.67 28.8,7.14 28.32,6.09 31.59,7.14 31.59,6.12 31.62,8.4 28.59,10.12 40.58,19.08 39.74,19.08 42.46,20.38 39.06,13.14 39.06,11.87 40.84,13.14 27.96,18.6 35.72,19.33 33.89,15.77 25.91,6.1 24.64,6.1 23.37,0.76 23.37,2.03 23.37,4.83 23.37,3.43 33.02,6.1 36.58,2.29 36.58,0.76 36.58,5.33 32.86,7.14 36.58,3.81 38.86,5.33 38.86,6.86 40.39,6.86 41.91,6.86 43.43,6.86 43.43,5.33 43.43,3.81 43.43,2.29 43.43,0.76 41.91,0.76 40.39,0.76 38.86,0.76 42.92,11.69 42.92,13.21 42.92,14.74 42.92,16.26 42.92,17.79 42.92,19.31 39.95,13.14 39.95,11.87 23.37,15.24 23.37,16.76 23.37,18.29 23.37,19.81 24.38,19.81 24.38,18.29 24.38,16.76 24.38,15.24 38.86,3.81 40.39,3.81 41.91,3.81 25.65,23.62
  pour Top (isolate 0.254): 22.35,24.64 22.35,-1.02 44.7,-1.02 44.7,24.64
  pour Bottom (isolate 0.254): 22.35,24.64 22.35,-2.79 44.7,-2.79 44.7,24.64
  pour Top (isolate 0.203): 28.38,9.67 28.38,5.71 31.78,5.71 31.78,8.41 30.77,9.67
GNDA  (via drill 0.3)
  Top 0.203: 20.57,28.14 20.57,28.15 20.71,28.29 20.71,28.64 20.64,28.71 21.37,29.46
  Top 0.229: 20.71,28.29 arc-90 21.86,29.43
  Top 0.254: 7.71,31.91 8.22,32.41 | 8.22,32.41 8.33,32.53 | X4.4 8.22,32.5 8.22,32.41 | X4.2 9.57,33.95 9.57,33.98 | U4.32 12.56,35.06 12.26,35.06 11.65,34.45 11.65,33.03 10.81,32.19 | C45.2 8.64,40.97 8.64,39.17
  Top 0.304: 9.48,33.98 9.57,33.98 10.32,33.98 10.48,34.14
  Top 0.305: 10.48,34.14 v10.48,34.32 | C56.2 C55.2 7.12,32.5 7.71,31.91 7.68,31.87 C54.2 | 11.65,33.03 11.67,33.05 v11.17,32.79
  Top 0.356: 8.64,39.17 8,39.17 | 8,39.17 7.26,38.43 | 7.77,39.17 8,39.17
  Top 0.406: 8.64,38.15 C47.2
  Top 0.508: 8.64,39.17 8.64,38.15
  Bottom 0.203: 10.29,44.28 11.4,44.28 11.68,44.01 v11.68,43.89
  Bottom 0.254: v10.48,34.32 10.62,34.45 10.92,34.75
  other vias: 22.86,36.27 22.86,37.8 22.86,39.32 22.86,43.89 19.05,43.89 17.46,41.32 17.43,42.85 17.91,43.9 14.64,42.85 14.64,43.87 14.61,41.59 17.63,39.87 5.65,30.91 6.48,30.91 3.77,29.61 7.17,36.85 7.17,38.12 5.39,36.85 18.27,31.39 10.51,30.66 12.34,34.22 20.32,43.89 21.59,43.89 22.86,49.23 22.86,47.96 22.86,45.16 22.86,46.56 13.21,43.89 9.65,47.7 9.65,49.23 9.65,44.65 13.37,42.85 9.65,46.18 7.37,44.65 7.37,43.13 5.84,43.13 4.32,43.13 2.79,43.13 2.79,44.65 2.79,46.18 2.79,47.7 2.79,49.23 4.32,49.23 5.84,49.23 7.37,49.23 3.31,38.3 3.31,36.77 3.31,35.25 3.31,33.72 3.31,32.2 3.31,30.68 6.28,36.85 6.28,38.12 22.86,34.75 22.86,33.22 22.86,31.7 22.86,30.18 21.84,30.18 21.84,31.7 21.84,33.22 21.84,34.75 7.37,46.18 5.84,46.18 4.32,46.18 20.57,26.37
  pour Top (isolate 0.254): 23.88,25.35 23.88,51 1.52,51 1.52,25.35
  pour Bottom (isolate 0.254): 23.88,25.35 23.88,52.78 1.52,52.78 1.52,25.35
  pour Top (isolate 0.203): 17.85,40.31 17.85,44.27 14.44,44.27 14.44,41.58 15.45,40.31
GNDIO  (via drill 0.66 pad 1.09, 1.02 pad 1.52)
  Top 0.254: v48.51,23.62 v48.51,22.35 49.02,22.35 49.4,21.97 49.4,19.81 | 49.4,19.81 49.4,2.16 v48.26,1.02 | v48.51,19.81 49.4,19.81
N$1
  Top 0.203: 10.1,10.43 10.75,9.78 11.21,9.78
  Top 0.254: 10.1,10.43 10.09,10.43 U2.24 | 11.21,9.78 C231.1
N$2
  Top 0.203: 11.21,8.76 11.08,8.76 | 9.6,10.43 9.6,10.23 9.6,10.1 10.82,8.89 11.05,8.89 C231.2
  Top 0.254: 9.6,10.43 9.58,10.44 U2.23 | C231.2 11.18,8.76 11.08,8.76
N$3
  Top 0.254: U2.21 8.59,10.38 8.59,9.73 8.59,9.6 9.53,8.65 C211.1
N$4
  Top 0.254: U2.6 7.58,16.62 C61.1
N$5
  Top 0.254: C261.1 12.02,11.53 11.62,11.94 U2.26
N$6
  Top 0.203: 13.76,17.33 13.76,17.02 13.01,17.02 12.2,16.2 12.2,15.24 11.4,14.44 11.36,14.44
  Top 0.254: 11.36,14.44 11.11,14.42 U2.31 | X1.1 13.8,17.36 13.8,17.42 | C311.1 13.8,18.51
  Top 0.304: 13.76,17.33 13.8,17.33 13.8,17.42 13.8,18.51
N$7
  Top 0.203: 11.08,13.95 11.11,13.95 11.48,13.95 12.48,14.96 14.61,14.96 14.94,15.29 14.94,15.9
  Top 0.254: 11.08,13.95 U2.30 | X1.3 14.9,15.91 14.9,15.9 | C302.1 C301.1 15.93,16.48
  Top 0.304: 15.93,16.48 15.35,15.9 14.94,15.9 14.9,15.9 14.88,15.91
N$8
  Top 0.203: 15.65,14.53 12.66,14.53 11.56,13.43 11.13,13.43 11.08,13.42 U2.29
  Top 0.254: 15.65,14.53 15.71,14.58 15.73,14.58 C291.1 | U2.29
N$9
  Top 0.254: U2.20 F1.1
N$10
  Top 0.254: U2.19 7.58,8.74 F1.2
N$11
  Top 0.254: 7.09,6.75 6.92,6.37 7.27,6.37 7.12,6.7 | 7.09,6.32 7.09,6.98 | ANT_868.RF 7.09,2.79 7.09,2.82
  Top 0.305: 7.09,6.75 7.09,6.98 F1.7
  Top 0.61: 7.09,2.82 7.09,6.32
N$12
  Top 0.254: U2.18 F1.3
N$13
  Top 0.254: R141.2 4.58,12.04 4.96,12.42 U2.14
N$14
  Top 0.254: 6.59,9.76 U2.17 6.59,10.36 | 6.59,9.76 F1.4 | L171.2 4.99,8.51 5.9,9.42 6.25,9.42 6.59,9.76
N$15
  Top 0.203: 36.13,39.56 35.48,40.21 35.02,40.21
  Top 0.254: 36.13,39.56 36.14,39.55 U1.24 | 35.02,40.21 C1.1
N$16
  Top 0.203: 35.02,41.23 35.15,41.23 | 36.63,39.56 36.63,39.76 36.63,39.88 35.41,41.1 35.17,41.1 C1.2
  Top 0.254: 36.63,39.56 36.64,39.55 U1.23 | C1.2 35.05,41.23 35.15,41.23
N$17
  Top 0.254: U1.21 37.63,39.61 37.64,40.26 37.64,40.39 36.69,41.34 C3.1
N$18
  Top 0.254: C5.1 34.2,38.46 34.61,38.05 U1.26
N$19
  Top 0.254: R171.2
  Top 0.305: 4.18,7.04 R171.2 C173.1 | L171.1 R171.2
N$20
  Top 0.203: 30.57,35.46 33.57,35.46 34.67,36.56 35.09,36.56 35.15,36.57 35.42,36.57
  Top 0.254: 30.57,35.46 30.52,35.41 30.5,35.41 C8.1 | 35.42,36.57 U1.29
N$21
  Top 0.254: U1.6 38.65,33.37 C12.1
N$22
  Top 0.203: 32.47,32.65 32.47,32.97 33.22,32.97 34.03,33.78 34.03,34.75 34.83,35.55 34.87,35.55
  Top 0.254: 34.87,35.55 35.12,35.56 U1.31 | X2.1 32.43,32.63 32.43,32.57 | C13.1 32.43,31.47
  Top 0.304: 32.47,32.65 32.43,32.65 32.43,32.57 32.43,31.47
N$23
  Top 0.203: 35.15,36.04 35.12,36.03 34.75,36.03 33.75,35.03 31.61,35.03 31.28,34.7 31.28,34.09
  Top 0.254: 35.15,36.04 U1.30 | X2.3 31.33,34.08 31.33,34.09 | C15.1 C14.1 30.29,33.51
  Top 0.304: 30.29,33.51 30.88,34.09 31.28,34.09 31.33,34.09 31.34,34.08
N$24
  Top 0.254: R1.2 41.65,37.95 41.27,37.57 U1.14
N$25
  Top 0.254: U1.20 38.14,41.26 F2.1
N$26
  Top 0.254: U1.19 38.65,41.25 F2.2
N$27
  Top 0.254: U1.18 F2.3
N$28
  Top 0.254: 39.63,40.22 U1.17 39.64,39.63 | 39.63,40.22 F2.4 | L1.2 41.24,41.48 40.33,40.57 39.98,40.57 39.63,40.22
N$29
  Top 0.254: R2.2
  Top 0.305: 42.05,42.95 R2.2 C19.1 | L1.1 R2.2
N$30
  Top 0.254: 39.13,43.23 39.31,43.62 38.95,43.62 39.11,43.28 | 39.13,43.66 39.13,43.01 | ANT_1.RF 39.13,47.2 ANT_1.RF
  Top 0.305: 39.13,43.23 39.13,43.01 F2.7
  Top 0.61: ANT_1.RF 39.13,43.66
N$31  (via drill 0.3)
  Top 0.203: 32.95,10.43 33.61,9.78 33.73,9.65 v34.06,9.65
  Top 0.254: 32.95,10.43 U3.24
  Bottom 0.203: v34.06,9.65 35.75,9.65 C22.1
N$32  (via drill 0.3)
  Top 0.203: 32.45,10.43 32.46,10.23 32.46,10.1 33.55,9.01 34.41,9.01 v34.67,9.02
  Top 0.254: 32.45,10.43 32.44,10.44 U3.23
  Bottom 0.203: v34.67,9.02 36.68,9.02 C22.2
N$33  (via drill 0.3)
  Top 0.254: U3.21 31.45,10.38 31.45,9.73 31.45,9.6 33.76,7.29 v34.29,7.29
  Bottom 0.254: C24.1 35.81,6.6 35.56,6.6 34.87,7.29 v34.29,7.29
N$34
  Top 0.254: U3.26 34.48,11.94 C26.1
N$35
  Top 0.203: 38.52,14.53 35.52,14.53 34.42,13.43 33.99,13.43 33.94,13.42 U3.29
  Top 0.254: 38.52,14.53 38.57,14.58 38.59,14.58 C29.1 | U3.29
N$36
  Top 0.254: U3.6 30.44,16.62 C32.1
N$37
  Top 0.203: 36.75,17.46 36.75,17.14 | 34.22,14.44 34.26,14.44 35.06,15.24 35.06,16.2 36.34,17.49 X3.1 | 36.79,17.55 36.79,19.05 C33.1
  Top 0.254: 34.22,14.44 33.97,14.42 U3.31 | X3.1 36.79,17.49 36.79,17.55
  Top 0.304: 36.75,17.46 36.79,17.46 36.79,17.55
N$38
  Top 0.203: 33.94,13.95 33.97,13.95 34.34,13.95 35.34,14.96 37.47,14.96 37.93,15.41 37.93,16.02 | C35.1 C34.1 38.97,16.04 X3.3
  Top 0.254: 33.94,13.95 U3.30 | X3.3 37.88,16.04 37.88,16.02
  Top 0.304: 37.87,16.04 37.88,16.02 37.93,16.02
N$39
  Top 0.254: U3.14 27.7,12.42 27.3,12.03 27.3,11.56 26.41,10.66 R4.2
N$40
  Top 0.254: U3.20 F3.1
N$41
  Top 0.254: U3.19 30.44,8.74 F3.2
N$42
  Top 0.254: U3.18 F3.3
N$43
  Top 0.254: 29.45,9.76 U3.17 29.45,10.36 | 29.45,9.76 F3.4 | 29.45,9.76 29.11,9.42 27.89,9.42 L2.2
N$44
  Top 0.254: L2.1 25.67,7.28 R5.2 C39.1
N$45
  Top 0.254: 29.95,6.63 29.01,5.72 | 30.38,5.74 30.91,5.71 | 30.91,5.71 30.01,6.58 | ANT_2.RF 29.95,2.79 29.95,2.82 | 29.01,5.33 29.01,5.71 29.4,5.72 29.01,5.72 | 30.53,5.31 30.53,5.59 | 30.53,5.59 30.53,5.69 | 29.01,5.72 30.38,5.74 | 30.38,5.74 30.53,5.59 | 30.91,5.33 30.91,5.59 | 30.91,5.59 30.91,5.71 | 30.91,5.71 30.91,5.59
  Top 0.305: F3.7 29.95,6.63 29.95,5.31
  Top 2.159: 29.95,2.82 29.95,5.31
N$46  (via drill 0.3)
  Top 0.203: 13.27,39.56 12.62,40.21 12.49,40.34 v12.17,40.34
  Top 0.254: 13.27,39.56 13.28,39.55 U4.24
  Bottom 0.203: v12.17,40.34 10.48,40.34 C42.1
N$47  (via drill 0.3)
  Top 0.203: 13.77,39.56 13.77,39.76 13.77,39.88 12.68,40.97 11.81,40.97 v11.56,40.97
  Top 0.254: 13.77,39.56 13.78,39.55 U4.23
  Bottom 0.203: v11.56,40.97 9.54,40.97 C42.2
N$48  (via drill 0.3)
  Top 0.254: U4.21 14.77,39.61 14.78,40.26 14.78,40.39 12.47,42.7 v11.94,42.7
  Bottom 0.254: C44.1 10.41,43.38 10.67,43.38 11.35,42.7 v11.94,42.7
N$49
  Top 0.254: U4.26 11.75,38.05 10.37,39.44 C46.1
N$50
  Top 0.203: 7.71,35.46 10.71,35.46 11.81,36.56 12.23,36.56 12.29,36.57 12.56,36.57
  Top 0.254: 7.71,35.46 7.66,35.41 7.64,35.41 C49.1 | 12.56,36.57 U4.29
N$51
  Top 0.254: U4.6 15.79,33.37 C53.1
N$52
  Top 0.203: 9.48,32.53 9.48,32.84 | 12.01,35.55 11.97,35.55 11.17,34.75 11.17,33.78 9.88,32.5 X4.1 | 9.44,32.44 9.44,30.94 C54.1
  Top 0.254: 12.01,35.55 12.26,35.56 U4.31 | X4.1 9.44,32.5 9.44,32.44
  Top 0.304: 9.48,32.53 9.44,32.53 9.44,32.44
N$53
  Top 0.203: 12.29,36.04 12.26,36.03 11.89,36.03 10.89,35.03 8.75,35.03 8.3,34.57 8.3,33.96 | C56.1 C55.1 7.25,33.95 X4.3
  Top 0.254: 12.29,36.04 U4.30 | X4.3 8.35,33.95 8.35,33.96
  Top 0.304: 8.36,33.95 8.35,33.96 8.3,33.96
N$54
  Top 0.254: U4.14 18.53,37.57 18.92,37.96 18.92,38.43 19.82,39.32 R6.2
N$55
  Top 0.254: U4.20 15.28,41.26 F4.1
N$56
  Top 0.254: U4.19 15.79,41.25 F4.2
N$57
  Top 0.254: U4.18 F4.3
N$58
  Top 0.254: 16.77,40.22 U4.17 16.78,39.63 | 16.77,40.22 F4.4 | 16.77,40.22 17.12,40.57 18.34,40.57 L3.2
N$59
  Top 0.254: L3.1 20.56,42.71 R7.2 C60.1
N$60
  Top 0.254: 16.27,43.36 17.22,44.27 | 15.85,44.25 15.31,44.27 | 15.31,44.27 16.22,43.41 | ANT_3.RF 16.27,47.2 ANT_3.RF | 17.22,44.65 17.22,44.27 16.83,44.26 17.22,44.27 | 15.7,44.68 15.7,44.4 | 15.7,44.4 15.7,44.3 | 17.22,44.27 15.85,44.25 | 15.85,44.25 15.7,44.4 | 15.32,44.65 15.32,44.4 | 15.32,44.4 15.32,44.27 | 15.31,44.27 15.31,44.4 15.32,44.4
  Top 0.305: F4.7 16.27,43.36 16.27,44.68
  Top 2.159: ANT_3.RF 16.27,44.68
N$64  (via drill 0.66 pad 1.09)
  other vias: 48.51,21.08
RADIO_3V3  (via drill 0.3)
  Top 0.254: U2.5 8.09,17.25 C51.1 8.1,17.26 v7.36,17.98 | 4.12,8.18 R171.1 | U2.22 9.1,10.39 9.09,10.38 9.1,9.91 9.1,9.87 10.37,8.6 C221.1 10.4,8.28 | U2.25 11.16,11.43 11.97,10.61 C251.1 12.15,10.66 v11.13,10.66 | U2.27 12.4,12.42 | 12.4,12.42 12.48,12.42 C271.1 | 10.24,8.25 10.4,8.28 | 4.54,11.17 5.33,11.95 5.57,11.95 5.57,11.94 U2.15 | 4.54,11.17 4.68,11.17 v5.01,10.84 | C151.1 4.15,11.17 | C151.1 4.07,11.17 | 4.54,11.17 C151.1 | U2.13 4.18,12.93 C131.1 4.2,12.9 4.2,13.08 3.67,13.61 1.71,13.61 1.69,13.59 v1.61,13.71 | 3.98,14.37 3.16,15.19 v2.93,15.19 | 3.98,14.37 4.91,13.43 U2.12 | 13.62,13.05 13.12,13.56 13.12,13.69 | 13.62,13.05 14.44,13.05 v14.66,12.82 | 13.62,13.05 13.04,13.05 12.61,12.62 | 12.61,12.62 12.48,12.49 | 13.12,13.69 12.63,13.69 11.87,12.93 11.11,12.92 U2.28 | 12.48,12.49 | U2.28 | C281.1 13.12,13.69 | 10.1,15.94 10.09,15.94 | 10.74,16.49 10.7,16.53 C11.1 | 10.74,16.49 v11.13,16.1 | v11.39,7.44 10.42,8.4 10.4,8.15 | 3.97,14.3 C121.1 3.79,14.37 3.98,14.37 | 10.1,15.94 10.1,16 10.59,16.49 10.74,16.49 | 12.48,12.34 12.48,12.49 | 12.48,12.49 12.48,12.62 12.61,12.62 | 10.4,8.28 10.4,8.15 | 10.4,8.15 10.37,8.15 | C172.1 | 10.1,15.94 U2.1 | U2.28 | 12.48,12.49 12.4,12.42 | 13.12,13.69 13.11,13.69 C281.1
  Top 0.305: C173.2 R171.1 | C172.1 C171.1 4.12,8.18 | v5.01,10.84 5.01,10.44 4.63,10.06 C172.1 | v14.66,12.82 14.68,12.84
  Top 0.406: JP1.8 20.88,20.88 20.88,8.53 20.07,7.72 15.88,7.72 15.37,8.23 15.37,12.12 v14.66,12.82
  Bottom 0.254: v14.66,12.82 14.66,12.52 14.49,12.34 | v7.36,17.98 7.23,17.9
  Bottom 0.305: v11.13,16.1 11.13,12.34 | 11.13,12.34 v11.13,10.66 | 14.49,12.34 11.13,12.34 | v11.13,10.66 10.96,10.84 v5.01,10.84 1.63,10.84 1.35,11.12 1.35,13.46 v1.61,13.71 1.61,14.6 2.19,15.19 v2.93,15.19 3.18,15.44 3.18,17.05 3.55,17.42 6.99,17.42 7.23,17.66 7.23,17.9 | v11.13,10.66 11.13,8.93 11.43,8.64 11.43,7.48 v11.39,7.44
RADIO_GND  (via drill 0.3)
  Top 0.254: 15.53,18.16 15.53,17.95 15.02,17.45 | 15.02,17.45 14.91,17.33 | X1.4 15.02,17.36 15.02,17.45 | X1.2 13.67,15.91 13.67,15.88 | 14.82,18.51 C311.2 | C301.2 16.01,18.51 | C302.2 16.93,17.68 16.95,17.7 | 11.77,16.96 11.72,16.96 11.72,15.54 11.11,14.92 U2.32 | 11.82,17.01 11.88,17.07 11.82,17.07 R12.1 11.82,18.08 | 11.82,17.01 11.77,16.96 | 11.82,16.96 11.77,16.96 | R12.2 11.82,17.01 | 11.26,18.59 10.7,18.59 C11.2 | 11.77,18.03 arc-90 11.85,17.95 11.85,18.08 11.82,18.08 | 11.82,18.08 11.82,18.59 | 11.82,18.59 11.26,18.59 | 11.82,18.59 v12.76,18.72 12.76,18.63 12.72,18.59 11.39,18.59 | 11.26,18.06 11.26,18.59 | 11.94,18.03 10.67,18.03 10.7,18.01
  Top 0.304: 13.76,15.88 13.67,15.88 13.05,15.88 12.76,15.59 | 16.95,17.47 16.95,17.7 16.95,18.21 16.65,18.51 16.62,18.51 | 15.53,18.51 14.82,18.51 | 15.53,18.51 15.53,18.16 | 15.68,18.51 15.53,18.51
  Top 0.305: C51.2 | 7.07,18.69 6.56,18.18 6.43,18.18 | C151.2 2.19,11.17 2.19,12.04 | 2.19,12.04 R141.1 | C131.2 2.35,12.9 2.35,12.8 2.19,12.8 2.19,12.04 | C172.2 2.21,10.06 2.17,10.11 | C171.2 2.44,9.14 1.99,9.6 1.99,9.98 | 1.99,9.98 1.99,11.35 v2.14,11.55 | 2.07,10.06 1.99,9.98 | 12.76,15.59 12.76,15.54 v12.79,15.54
  Top 0.406: 10.73,17.98 10.7,18.01 C11.2 | C61.2 5.83,17.87 5.97,18.01 6.26,18.01 6.43,18.18 | C121.2 2.52,14.3 2.14,14.68 0.62,14.58
  Top 0.508: 16.62,18.51 16.01,18.51 15.68,18.51
  Bottom 0.254: 0.97,10.41 1.28,10.11 2.17,10.11
  other vias: 2.14,12.24 5.47,6.09 8.75,6.09 5.72,10.13 2.14,12.93 5.95,8.66 8.7,8.66 5.95,7.13 8.7,7.13 4.33,20.39 20.07,11.68 20.07,13.21 20.07,14.73 20.07,16.26 20.07,17.78 20.07,19.3 19.61,20.37 20.57,0.76 20.57,2.29 20.57,3.81 20.57,5.33 20.57,6.86 18.8,6.86 17.02,6.86 15.24,6.86 18.8,0.76 17.02,0.76 13.46,2.29 15.24,0.76 13.46,0.76 13.46,3.81 13.46,5.33 14.48,11.43 12.19,6.1 10.41,6.1 12.19,9.65 12.19,7.87 13.46,6.86 14.48,7.87 14.48,9.65 13.34,7.87 13.34,9.65 15.24,3.81 17.02,3.81 18.8,3.81 3.81,6.1 0.76,5.33 0.76,3.81 0.76,0.76 0.76,2.29 2.03,6.1 0.76,6.86 0.76,8.38 0.76,9.91 0.64,11.43 0.64,12.95 0.76,14.48 0.76,16 2.29,16 2.29,17.53 0.76,17.53 0.76,19.05 2.29,19.05 0.76,20.57 5.33,23.62 1.52,19.05 1.52,17.53 1.52,16 2.03,8.38 2.03,9.91 2.03,6.86 17.53,19.3 15.75,19.3 17.53,18.54 15.75,18.54 16.64,19.3 16.64,18.54 18.03,17.78 18.03,16.26 18.03,14.73 18.03,13.21 16.76,11.94 16.76,13.21 15.49,13.21 14.99,13.72 6.99,19.18 6.1,18.29 8.13,19.18 2.29,20.57 2.79,23.62
  pour Top (isolate 0.203): 5.52,9.67 5.52,5.71 8.92,5.71 8.92,9.67
  pour Top (isolate 0.254): -1.02,24.64 21.59,24.64 21.59,-2.03 -1.02,-2.03
  pour Bottom (isolate 0.254): -1.02,24.64 21.59,24.64 21.59,-5.59 -1.02,-5.59
RADIO_GPIO0_A  (via drill 0.3)
  Top 0.254: U2.10 5.39,14.42 3.51,16.3 3.51,19.36 v3.81,19.66
  Bottom 0.254: v3.81,19.66 4.83,19.66 5.08,19.91 11.18,19.91 11.81,20.55 13.08,20.55 14.22,21.69 JP1.6
RADIO_GPIO0_A1  (via drill 0.3)
  Top 0.254: U1.10 40.84,35.56 42.71,33.68 42.71,30.62 v42.42,30.33
  Bottom 0.254: v42.42,30.33 41.4,30.33 41.15,30.07 35.05,30.07 34.42,29.44 33.15,29.44 32,28.3 JP3.6
RADIO_GPIO0_D  (via drill 0.3)
  Top 0.254: U3.10 27.99,14.42 27.3,15.11 26.59,15.11 25.65,16.05 25.65,19.74 v25.96,20.04
  Bottom 0.254: JP6.6 35.18,20.55 34.67,20.55 34.16,20.04 v25.96,20.04
RADIO_GPIO0_D1  (via drill 0.3)
  Top 0.254: U4.10 18.23,35.56 18.92,34.87 19.63,34.87 20.57,33.93 20.57,30.25 v20.27,29.95
  Bottom 0.254: JP5.6 11.05,29.44 11.56,29.44 12.06,29.95 v20.27,29.95
RADIO_GPIO2_A
  Top 0.254: U2.4 8.59,16.7 8.89,16.99 8.89,19.66 9.78,20.55 18.41,20.55 19.3,19.66 JP2.1
RADIO_GPIO2_A1
  Top 0.254: U1.4 37.63,33.29 37.34,32.99 37.34,30.33 36.45,29.44 27.81,29.44 26.92,30.33 JP4.1
RADIO_GPIO2_D
  Top 0.254: U3.4 31.45,16.7 31.75,16.99 31.75,19.66 32.64,20.55 41.27,20.55 42.16,19.66 JP7.1
RADIO_GPIO2_D1
  Top 0.254: U4.4 14.77,33.29 14.48,32.99 14.48,30.33 13.59,29.44 4.95,29.44 4.06,30.33 JP8.1
RADIO_GPIO3_A
  Top 0.254: U2.3 9.1,16.44 9.4,16.74 9.4,19.41 10.03,20.04 17.91,20.04 18.8,19.15 18.8,12.55 16.76,10.52 JP2.2
RADIO_GPIO3_A1
  Top 0.254: U1.3 37.13,33.55 36.83,33.25 36.83,30.58 36.2,29.95 28.32,29.95 27.43,30.84 27.43,37.44 29.46,39.47 JP4.2
RADIO_GPIO3_D
  Top 0.254: U3.3 31.96,16.44 32.26,16.74 32.26,19.41 32.89,20.04 40.77,20.04 41.66,19.15 41.66,12.55 39.62,10.52 JP7.2
RADIO_GPIO3_D1
  Top 0.254: U4.3 14.27,33.55 13.97,33.25 13.97,30.58 13.34,29.95 5.46,29.95 4.57,30.84 4.57,37.44 6.6,39.47 JP8.2
RADIO_RESET_N_A  (via drill 0.3)
  Top 0.254: U2.2 9.58,16.16 9.91,16.48 9.91,19.15 10.16,19.41 v11.94,19.41
  Bottom 0.254: v11.94,19.41 12.95,19.41 14.1,20.55 15.62,20.55 16.76,21.69 JP1.7
RADIO_RESET_N_A1  (via drill 0.3)
  Top 0.254: U1.2 36.64,33.82 36.32,33.5 36.32,30.84 36.07,30.58 v34.29,30.58
  Bottom 0.254: v34.29,30.58 33.27,30.58 32.13,29.44 30.61,29.44 29.46,28.3 JP3.7
RADIO_RESET_N_D  (via drill 0.3)
  Top 0.254: U3.2 32.44,16.16 32.77,16.48 32.77,19.15 33.02,19.41 v34.8,19.41
  Bottom 0.254: JP6.7 39.62,21.69 38.48,20.55 35.94,20.55 v34.8,19.41
RADIO_RESET_N_D1  (via drill 0.3)
  Top 0.254: U4.2 13.78,33.82 13.46,33.5 13.46,30.84 13.21,30.58 v11.43,30.58
  Bottom 0.254: JP5.7 6.6,28.3 7.75,29.44 10.29,29.44 v11.43,30.58
RADIO_SPI_CLK_A  (via drill 0.3)
  Top 0.254: U2.8 6.59,15.95 6.38,16.15 5.17,16.15 4.53,16.79 4.53,18.6 6.48,20.55 v7.87,20.55
  Bottom 0.254: v7.87,20.55 11.05,20.55 11.68,21.18 JP1.5
RADIO_SPI_CLK_A1  (via drill 0.3)
  Top 0.254: U1.8 39.64,34.04 39.84,33.84 41.06,33.84 41.7,33.2 41.7,31.39 39.75,29.44 v38.35,29.44
  Bottom 0.254: v38.35,29.44 35.18,29.44 34.54,28.8 JP3.5
RADIO_SPI_CLK_D  (via drill 0.3)
  Top 0.254: U3.8 29.45,15.89 29.21,16.13 27.05,16.13 26.67,16.51 26.67,19.05 28.17,20.55 30.73,20.55 v30.73,20.73
  Bottom 0.254: v30.73,20.73 30.73,20.55 33.91,20.55 34.54,21.18 JP6.5
RADIO_SPI_CLK_D1  (via drill 0.3)
  Top 0.254: U4.8 16.78,34.09 17.02,33.86 19.18,33.86 19.56,33.48 19.56,30.94 18.06,29.44 15.49,29.44 v15.49,29.26
  Bottom 0.254: v15.49,29.26 15.49,29.44 12.32,29.44 11.68,28.8 JP5.5
RADIO_SPI_CSN_A
  Top 0.254: U2.11 5.11,13.94 3.01,16.05 3.01,20.63 4.06,21.69 JP1.2
RADIO_SPI_CSN_A1
  Top 0.254: U1.11 41.11,36.05 43.22,33.94 43.22,29.35 42.16,28.3 JP3.2
RADIO_SPI_CSN_D
  Top 0.254: U3.11 27.71,13.94 27.05,14.61 26.34,14.61 25.15,15.8 25.15,20.14 26.92,21.92 JP6.2
RADIO_SPI_CSN_D1
  Top 0.254: U4.11 18.51,36.05 19.18,35.38 19.89,35.38 21.08,34.19 21.08,29.84 19.3,28.07 JP5.2
RADIO_SPI_MISO_A
  Top 0.254: U2.9 5.67,14.93 4.02,16.58 4.02,18.86 6.6,21.44 JP1.3
RADIO_SPI_MISO_A1
  Top 0.254: U1.9 40.55,35.05 42.21,33.4 42.21,31.13 39.62,28.55 JP3.3
RADIO_SPI_MISO_D
  Top 0.254: U3.9 28.25,14.93 27.56,15.62 26.8,15.62 26.16,16.26 26.16,19.3 27.94,21.08 28.7,21.08 29.46,21.84 JP6.3
RADIO_SPI_MISO_D1
  Top 0.254: U4.9 17.98,35.05 18.67,34.37 19.43,34.37 20.07,33.73 20.07,30.68 18.29,28.91 17.53,28.91 16.76,28.14 JP5.3
RADIO_SPI_MOSI_A
  Top 0.254: U2.7 7.09,16.3 6.74,16.66 5.37,16.66 5.04,16.99 5.04,18.35 6.6,19.91 8.38,19.91 9.14,20.68 JP1.4
RADIO_SPI_MOSI_A1
  Top 0.254: U1.7 39.13,33.68 39.49,33.33 40.86,33.33 41.19,33 41.19,31.64 39.62,30.07 37.85,30.07 37.08,29.31 JP3.4
RADIO_SPI_MOSI_D
  Top 0.254: U3.7 29.95,16.3 29.62,16.64 27.3,16.64 27.18,16.76 27.18,18.8 28.32,19.94 31.29,19.94 32,20.65 JP6.4
RADIO_SPI_MOSI_D1
  Top 0.254: U4.7 16.27,33.68 16.61,33.35 18.92,33.35 19.05,33.22 19.05,31.19 17.91,30.05 14.94,30.05 14.22,29.34 JP5.4
TCK  (via drill 0.66 pad 1.09, 1.02 pad 1.27)
  Top 0.254: v47.24,19.81 46.35,18.92 46.35,13.08 v48.26,11.18
TDI  (via drill 0.66 pad 1.09, 1.02 pad 1.27)
  Bottom 0.254: v47.24,22.35 46.35,21.46 46.35,8 v48.26,6.1
TDO  (via drill 0.66 pad 1.09, 1.02 pad 1.27)
  Top 0.254: v47.24,21.08 45.85,19.68 45.85,11.05 v48.26,8.64
TMS  (via drill 0.66 pad 1.09, 1.02 pad 1.27)
  Top 0.254: v47.24,18.54 47.12,18.41 47.12,14.86 v48.26,13.72
V+  (via drill 0.66 pad 1.09, 1.02 pad 1.27)
  Top 0.254: v48.51,18.54 48.51,16.51 v48.26,16.26
VCC  (via drill 0.3)
  Top 0.254: U1.5 38.14,32.74 C10.1 38.13,32.72 v38.87,32.01 | 42.11,41.81 R2.1 | U1.22 37.13,39.6 37.13,39.61 37.13,40.08 37.13,40.12 35.86,41.39 C2.1 35.83,41.71 | U1.25 35.07,38.56 34.26,39.37 C4.1 34.08,39.32 v35.09,39.32 | U1.27 33.82,37.57 | 33.82,37.57 33.75,37.57 C6.1 | 35.98,41.73 35.83,41.71 | 41.68,38.81 40.9,38.03 40.66,38.04 40.66,38.05 U1.15 | 41.68,38.81 41.55,38.81 v41.22,39.14 | C18.1 42.08,38.81 | C18.1 42.16,38.81 | 41.68,38.81 C18.1 | U1.13 42.05,37.06 C17.1 42.03,37.09 42.03,36.91 42.56,36.38 44.52,36.38 44.54,36.4 v44.62,36.27 | 42.25,35.62 43.07,34.8 v43.3,34.8 | 42.25,35.62 41.32,36.55 U1.12 | 32.6,36.93 33.11,36.43 33.11,36.3 | 32.6,36.93 31.79,36.93 v31.56,37.16 | 32.6,36.93 33.19,36.93 33.62,37.37 | 33.62,37.37 33.75,37.49 | 33.11,36.3 33.6,36.3 34.35,37.06 35.12,37.07 U1.28 | 33.75,37.49 | U1.28 | C7.1 33.11,36.3 | 36.13,34.04 36.14,34.04 | 35.49,33.49 35.53,33.45 C9.1 | 35.49,33.49 v35.09,33.89 | v35.09,42.29 35.55,41.84 35.83,41.84 | 42.26,35.69 C16.1 42.44,35.62 42.25,35.62 | 36.13,34.04 36.13,33.98 35.64,33.49 35.49,33.49 | 33.75,37.65 33.75,37.49 | 33.75,37.49 33.75,37.37 33.62,37.37 | 35.83,41.71 35.83,41.84 | 35.83,41.84 35.85,41.84 | C21.1 | 36.13,34.04 U1.1 | U1.28 | 33.75,37.49 33.82,37.57 | 33.11,36.3 33.12,36.3 C7.1
  Top 0.305: C19.2 R2.1 | C21.1 C20.1 42.11,41.81 | v41.22,39.14 41.22,39.55 41.6,39.93 C21.1 | v31.56,37.16 v31.55,37.15
  Top 0.406: JP3.8 25.35,29.11 25.35,41.45 26.16,42.27 30.35,42.27 30.86,41.76 30.86,37.87 v31.56,37.16
  Bottom 0.254: v31.56,37.16 31.56,37.47 31.74,37.65 | v38.87,32.01 39,32.08
  Bottom 0.305: v35.09,33.89 35.09,37.65 | 35.09,37.65 v35.09,39.32 | 31.74,37.65 35.09,37.65 | v35.09,42.29 v35.09,39.32 | v35.09,39.32 35.27,39.14 v41.22,39.14 44.59,39.14 44.87,38.87 44.87,36.53 v44.62,36.27 44.62,35.38 44.03,34.8 v43.3,34.8 43.04,34.55 43.04,32.93 42.68,32.57 39.23,32.57 39,32.33 39,32.08
VDD  (via drill 0.3)
  Top 0.254: U4.5 15.28,32.05 v15.25,32.01 15.41,31.85 C52.1 | C60.2 R7.1 | U4.22 14.27,39.6 14.27,39.61 14.27,40.08 14.27,40.12 12.58,41.81 v11.99,41.81 | U4.25 12.21,38.56 11.4,39.37 11.4,40.12 10.54,40.97 C45.1 | 10.25,36.3 10.25,36.43 10.23,36.4 C48.1 10.92,36.4 11.59,37.06 U4.28 11.68,37.06 v11.68,37.29 | 10.25,36.27 10.25,36.3 | 13.27,34.04 13.28,34.04 | 13.27,34.04 13.27,33.98 12.69,33.4 v12.69,33.23 12.7,33.12 12.7,31.92 12.51,31.92 C50.1 | 10.25,36.3 10.26,36.3 | 13.27,34.04 U4.1 | U4.1 | 18.54,36.55 19.69,36.55 C57.1 | v18.36,39.14 18.41,39.08 18.41,38.43 18.03,38.05 U4.15 | U4.27 11.68,37.57 | 11.68,37.57 11.53,37.57 11.18,37.92 C47.1 | 11.68,37.16 v11.68,37.29 | v11.68,37.29 11.68,37.57 | 18.54,37.06 19.08,37.06 19.82,37.8 C58.1 | U4.1 | U4.12 18.54,36.55 | 18.54,36.55 v18.54,36.78 18.54,37.06 | U4.13 18.54,37.06
  Top 0.305: R7.1 20.87,41.1 v19.85,41.1
  Top 0.406: 10.54,42.27 3.3,42.27 2.49,41.45 2.49,29.11 JP5.8 | 10.54,42.27 11.15,42.27 11.61,41.81 v11.99,41.81 | 10.54,40.97 10.54,42.27
  Bottom 0.254: v15.25,32.01 15.37,32.08 | C43.1 10.46,41.81 v11.99,41.81 | 12.07,41.81 12.02,41.86 | C59.1
  Bottom 0.305: 15.37,32.08 15.37,32.07 | C59.1 | 19.98,41.1 C63.1 | C62.1 19.98,41.1 | 19.98,41.1 v19.85,41.1 | C59.1 C63.1 | C63.1 19.05,40.08 18.36,39.39 v18.36,39.14
  Bottom 0.406: 11.73,36.78 11.73,39.11 12.19,39.57 12.57,39.57 12.97,39.97 12.97,41.27 12.43,41.81 v11.99,41.81 12.07,41.81 | 11.73,36.78 11.73,35.04 11.43,34.75 11.43,33.73 11.94,33.22 12.64,33.22 v12.69,33.23 13.1,33.63 15.24,33.63 | v11.68,37.29 11.73,36.78 | v18.36,39.14 18.54,38.96 v18.54,36.78 18.54,34.49 17.68,33.63 15.24,33.63 | 15.37,32.07 15.32,32.07 15.32,33.55 15.24,33.63

### Text on the board
tPlace: Breakout | Breakout | 868/915MHz | 868/915MHz | 0603 | CC1200 | 0402 | CC1200 | CC1120/ | CC1120/ | VCC | TMS | TCK | TDO | TDI | !RST | 868/915MHz | Quick, Dirty (& probably wrong) ARM JTAG Breakout | GND
bPlace: Other values per ref / design (swrc222.zip) / Passives are all 0603 | X1: 32MHz (CC1120) / 40MHz (CC1200) / F1: 0900PC15J0013 / (Farnell 2341894) | Graeme Bragg / University of / Southampton / April 2016 | Graeme Bragg / University of / Southampton / April 2016 | Other values per ref / design (swrc222.zip) | X1: 32MHz (CC1120) / 40MHz (CC1200) / F1: 0900PC15J0013 / (Farnell 2341894) | X1: 32MHz (CC1120) / 40MHz (CC1200) / F1: 0900PC15J0013 / (Farnell 2341894) | Other values per ref / design (swrc222.zip) | Graeme Bragg / University of / Southampton / April 2016 | Graeme Bragg / University of / Southampton / April 2016 | X1: 32MHz (CC1120) / 40MHz (CC1200) / F1: 0900PC15J0013 / (Farnell 2341894) | Other values per ref / design (swrc222.zip) / Passives are all 0603
tNames: Breakout | Breakout | ANT | 868/915MHz | ANT | 0603 | CC1200 | 0402 | CC1200 | CC1120/ | C231 | CC1120/ | C221 | C211 | R171 | C173 | R171 | IO2 | IO3 | C251 | IO2 | IO3 | L171 | C261 | F1 | C251 | F1 | C171 | L171 | C173 | C172 | C261 | C151 | C271 | C271 | R141 | C281 | C131 | C291 | C281 | R141 | C291 | C302 | C301 | C302 | C301 | X1 | C121 | X1 | C131 | R12 | C11 | C11 | C61 | C121 | C51 | C311 | C311 | C51 | 3V3 | !RST | IO0 | CLK | SI | SO | !CS | GND | 3V3 | !RST | IO0 | CLK | SI | SO | !CS | GND | GND | !CS | SO | SI | CLK | IO0 | !RST | 3V3 | GND | !CS | SO | SI | CLK | IO0 | !RST | 3V3 | C51 | C311 | C311 | C51 | C121 | C61 | C11 | C11 | R12 | X1 | C121 | X1 | C301 | C302 | C131 | C301 | C302 | C291 | R141 | C281 | C291 | C131 | C281 | R141 | C271 | C271 | C151 | C261 | C172 | C173 | L171 | C171 | F1 | C251 | F1 | C261 | L171 | IO3 | IO2 | C251 | IO3 | IO2 | R171 | C173 | R171 | C211 | C221 | C231 | CC1120/ | CC1120/ | CC1200 | 0402 | CC1200 | 0603 | ANT | 868/915MHz | ANT | Breakout | Breakout
bNames: C211 | C171 | C221 | C231 | C172 | C151 | C151 | C172 | C231 | C221 | C171 | C211